# EAGLE design Schematic SF 13_12_2020 V8 (EAGLE 9.6.2)
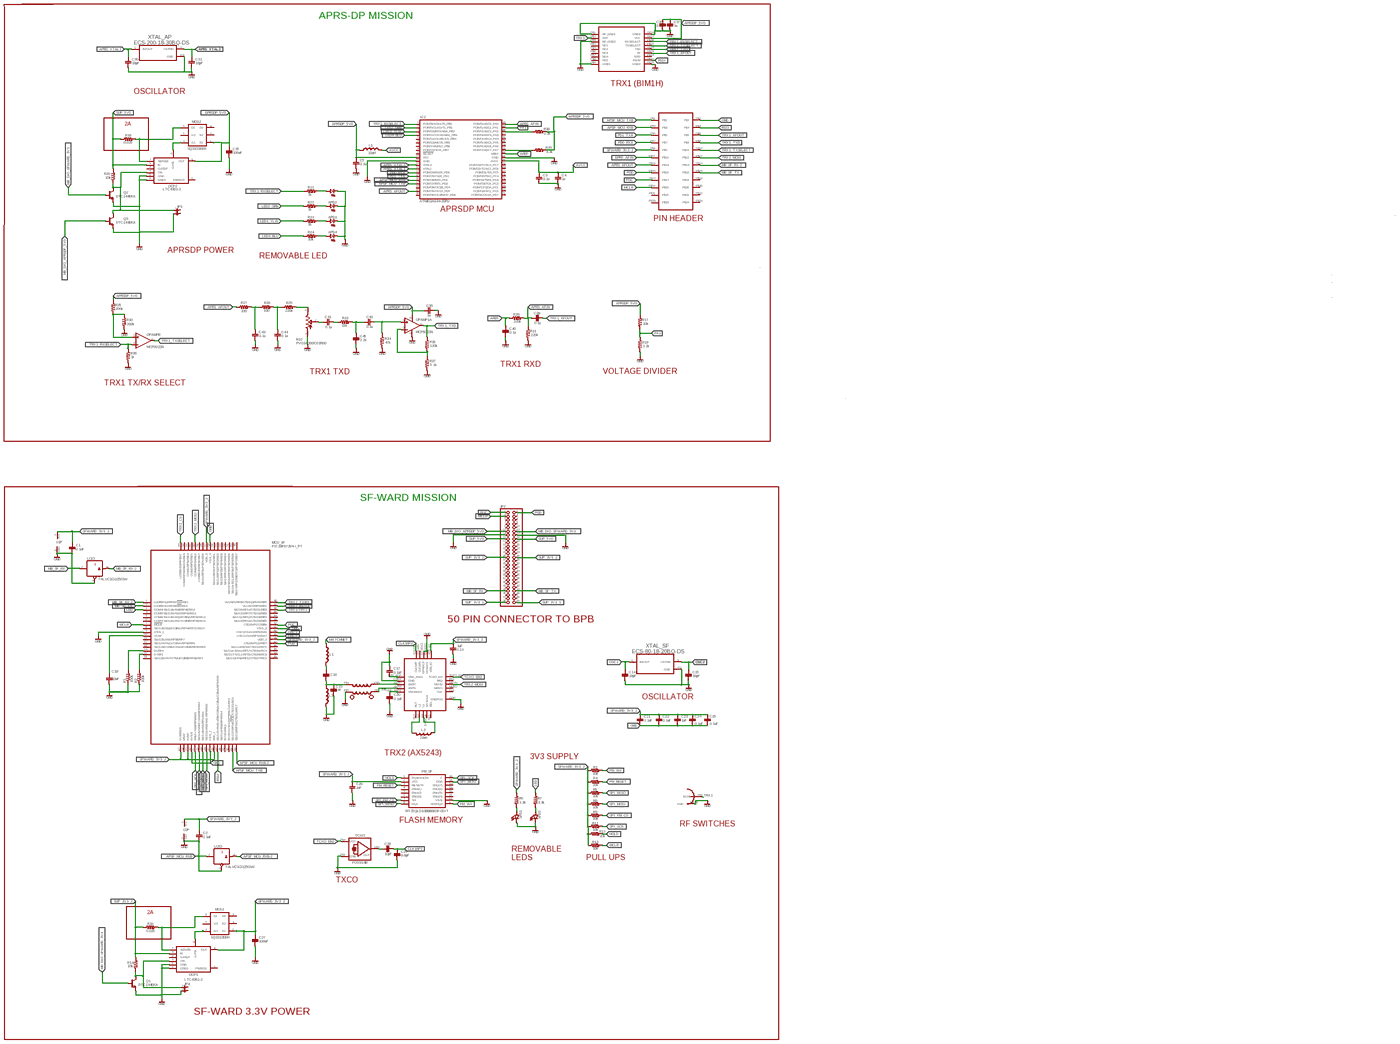
[diagram p0: schematic, sheet 1, overview]
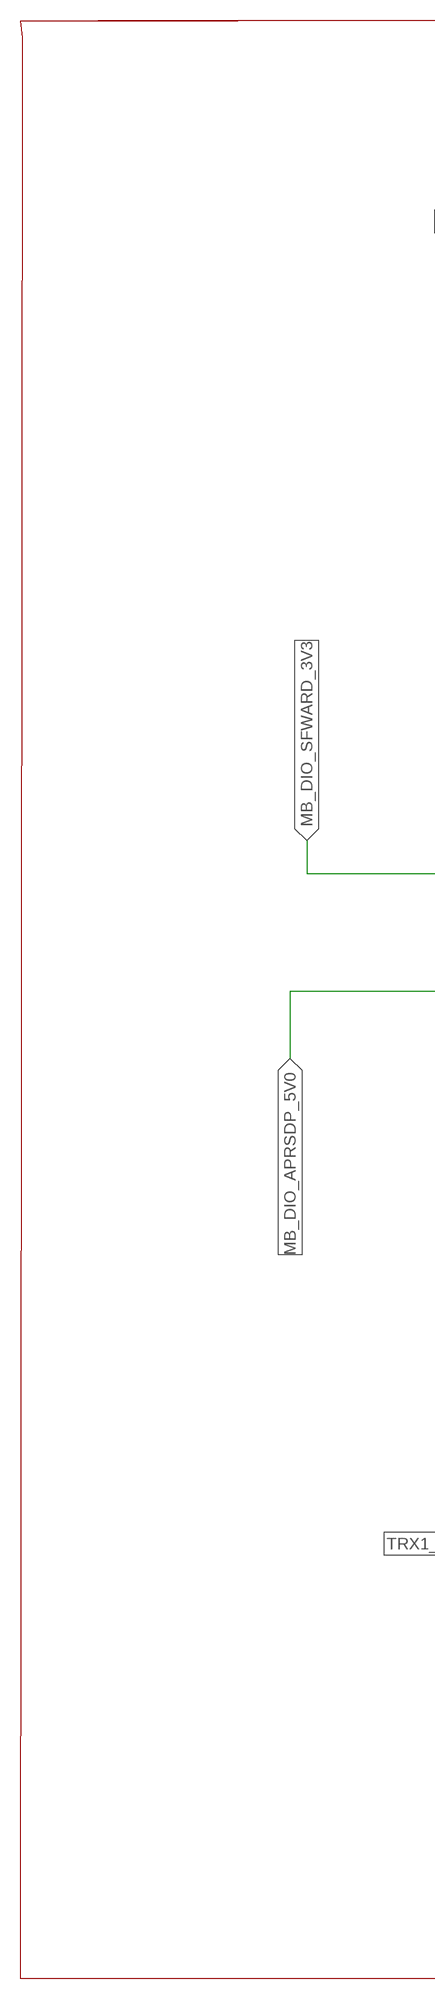
[diagram p1: schematic, sheet 1, part 1 of 4]
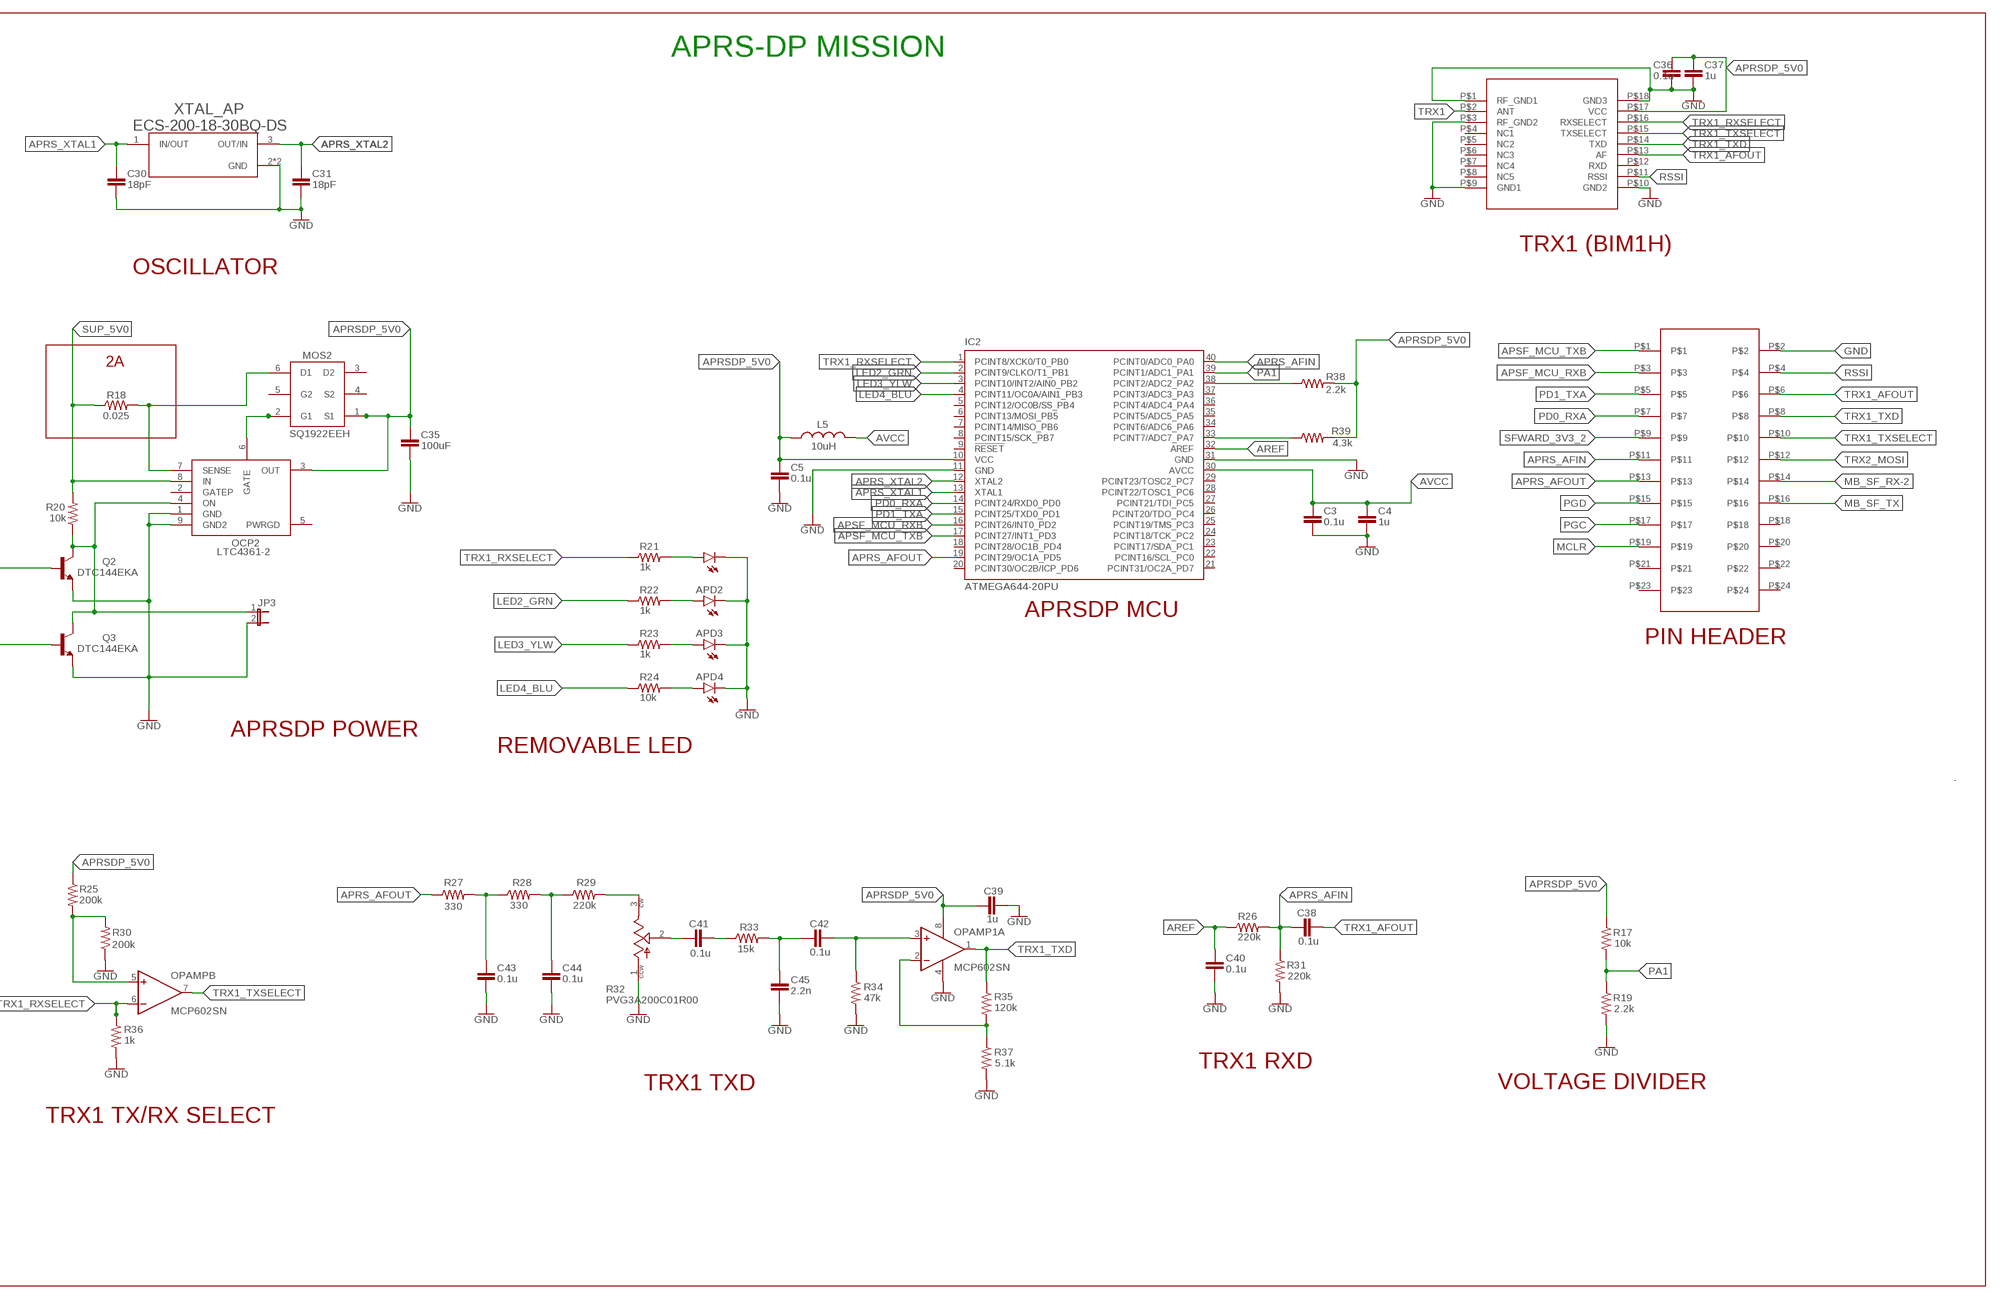
[diagram p2: schematic, sheet 1, part 2 of 4]
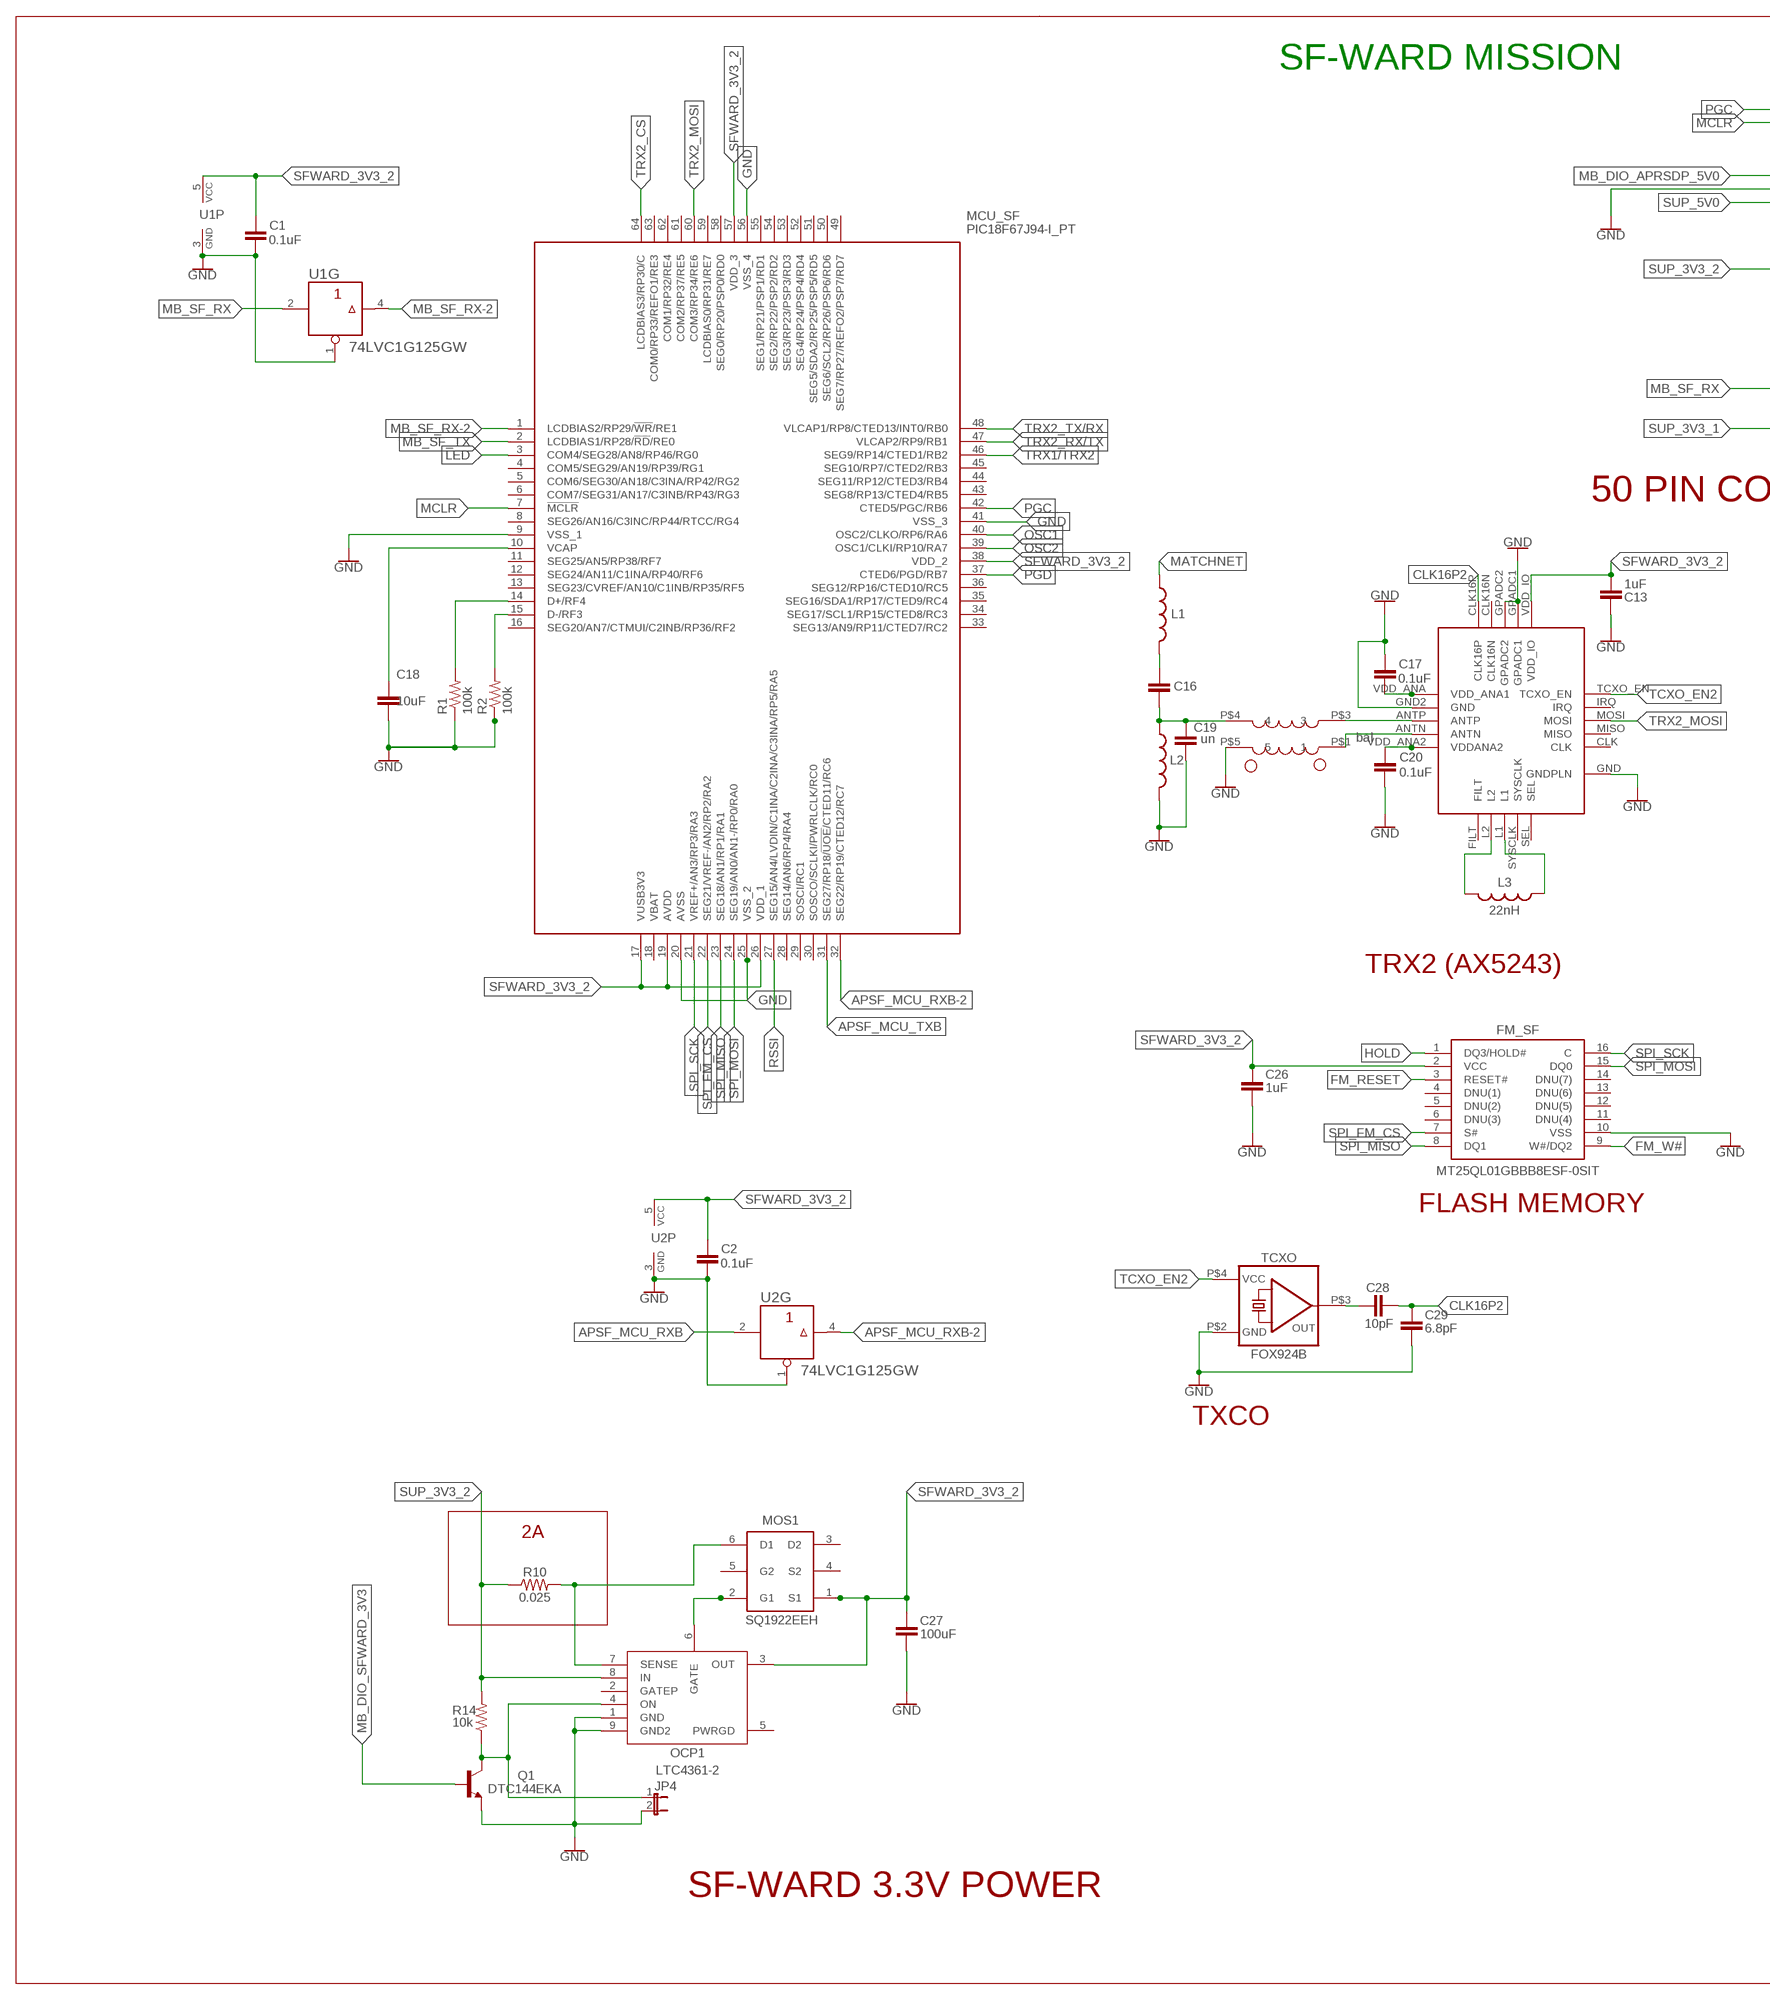
[diagram p3: schematic, sheet 1, part 3 of 4]
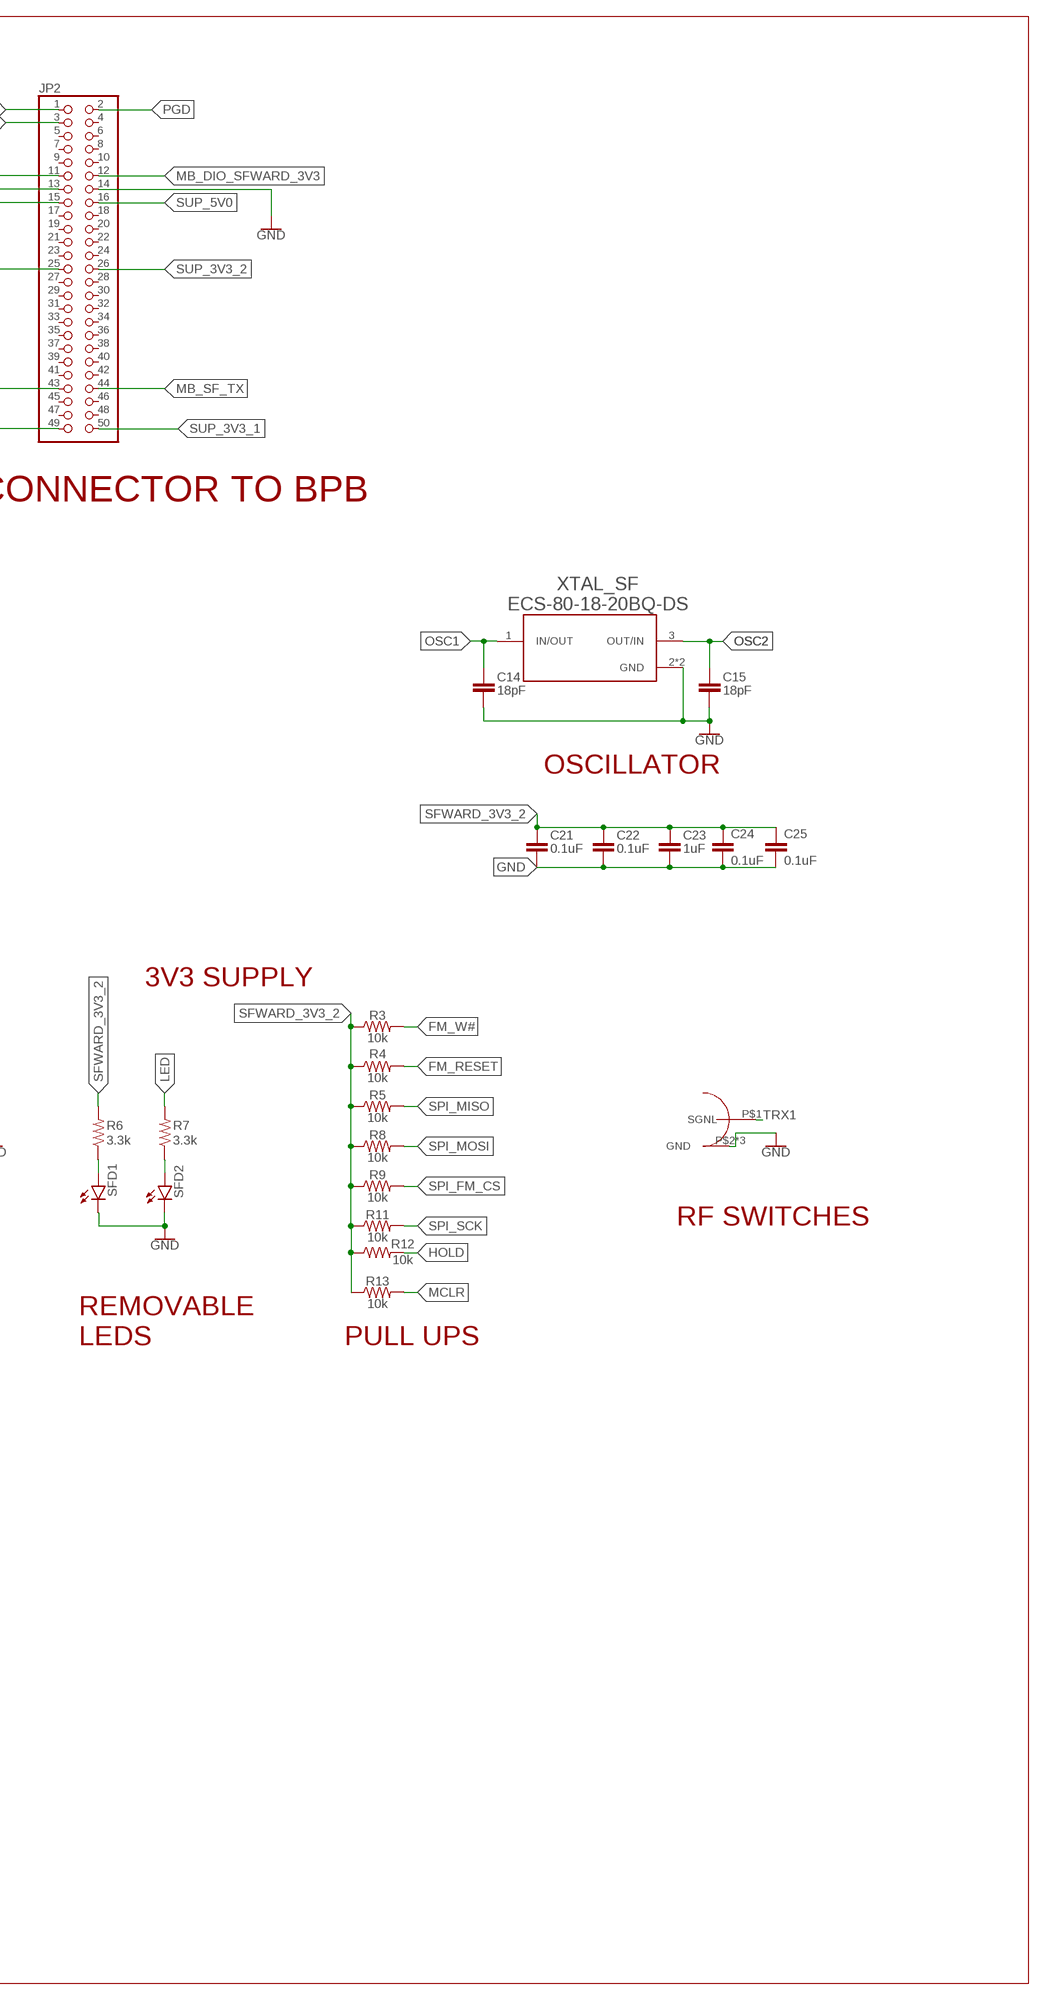
[diagram p4: schematic, sheet 1, part 4 of 4]

## Parts
APD1  LEDSML0603  [SML0603]
APD2  LEDSML0603  [SML0603]
APD3  LEDSML0603  [SML0603]
APD4  LEDSML0603  [SML0603]
BAL  MABA-010245-BALUN  [MABA-010245-BALUN]
C1  0.1uF  CC0603  [C0603]
C2  0.1uF  CC0603  [C0603]
C3  0.1u  CC0603  [C0603]
C4  1u  CC0603  [C0603]
C5  0.1u  CC0603  [C0603]
C13  1uF  CC0603  [C0603]
C14  18pF  CC0603  [C0603]
C15  18pF  CC0603  [C0603]
C16  C-EUC0805  [C0805]
C17  0.1uF  CC0603  [C0603]
C18  10uF  C-EUC0603  [C0603]
C19  C-EUC0805  [C0805]
C20  0.1uF  CC0603  [C0603]
C21  0.1uF  C-EUC0603  [C0603]
C22  0.1uF  C-EUC0603  [C0603]
C23  1uF  C-EUC0603  [C0603]
C24  0.1uF  C-EUC0603  [C0603]
C25  0.1uF  C-EUC0603  [C0603]
C26  1uF  C-EUC0603  [C0603]
C27  100uF  C0805(2012)  [C0805]
C28  10pF  CC0603  [C0603]
C29  6.8pF  CC0603  [C0603]
C30  18pF  CC0603  [C0603]
C31  18pF  CC0603  [C0603]
C35  100uF  C0805(2012)  [C0805]
C36  0.1u  CC0603  [C0603]
C37  1u  CC0603  [C0603]
C38  0.1u  CC0603  [C0603]
C39  1u  CC0603  [C0603]
C40  0.1u  CC0603  [C0603]
C41  0.1u  CC0603  [C0603]
C42  0.1u  CC0603  [C0603]
C43  0.1u  CC0603  [C0603]
C44  0.1u  CC0603  [C0603]
C45  2.2n  CC0603  [C0603]
FM_SF  MT25QL01GBBB8ESF-0SIT  [SOIC127P1032X265-16N]
IC2  ATMEGA644-20PU  [DIL40]
JP1  RAB_ACCESS  [RAB_ACCESS]
JP2  PINHD-2X25_2.00  [2X25M]
JP3  JP1E  [JP1]
JP4  JP1E  [JP1]
L1  L-USL2012C  [L2012C]
L2  L-USL2012C  [L2012C]
L3  22nH  L-USL2012C  [L2012C]
L5  10uH  L-USL2012C  [L2012C]
MCU_SF  PIC18F67J94-I_PT  [QFP50P1200X1200X120-64N]
MOS1  SQ1922EEH  [SOT65P210X110-6N]
MOS2  SQ1922EEH  [SOT65P210X110-6N]
OCP1  LTC4361-2  [DFN]
OCP2  LTC4361-2  [DFN]
OPAMP  MCP602SN  [SO08]
OPAMP1  MCP602SN  [SO08]
Q1  DTC144EKA  [SOT346-R]
Q2  DTC144EKA  [SOT346-R]
Q3  DTC144EKA  [SOT346-R]
R1  100k  R-US_R0603  [R0603]
R2  100k  R-US_R0603  [R0603]
R3  10k  R-US_R0603  [R0603]
R4  10k  R-US_R0603  [R0603]
R5  10k  R-US_R0603  [R0603]
R6  3.3k  R-US_R0603  [R0603]
R7  3.3k  R-US_R0603  [R0603]
R8  10k  R-US_R0603  [R0603]
R9  10k  R-US_R0603  [R0603]
R10  0.025  R0805(2012)  [R0805]
R11  10k  R-US_R0603  [R0603]
R12  10k  R-US_R0603  [R0603]
R13  10k  R-US_R0603  [R0603]
R14  10k  R-US_R0603  [R0603]
R17  10k  R-US_R0603  [R0603]
R18  0.025  R-US_R0805  [R0805]
R19  2.2k  R-US_R0603  [R0603]
R20  10k  R-US_R0603  [R0603]
R21  1k  R-US_R0603  [R0603]
R22  1k  R-US_R0603  [R0603]
R23  1k  R-US_R0603  [R0603]
R24  10k  R-US_R0603  [R0603]
R25  200k  R-US_R0603  [R0603]
R26  220k  R-US_R0603  [R0603]
R27  330  R-US_R0603  [R0603]
R28  330  R-US_R0603  [R0603]
R29  220k  R-US_R0603  [R0603]
R30  200k  R-US_R0603  [R0603]
R31  220k  R-US_R0603  [R0603]
R32  PVG3A200C01R00  [TRIM_PVG3A200C01R00]
R33  15k  R-US_R0603  [R0603]
R34  47k  R-US_R0603  [R0603]
R35  120k  R-US_R0603  [R0603]
R36  1k  R-US_R0603  [R0603]
R37  5.1k  R-US_R0603  [R0603]
R38  2.2k  R-US_R0603  [R0603]
R39  4.3k  R-US_R0603  [R0603]
RFCON  MMCX_908_222101T  [MMCX_908_222101T]
SFD1  LEDCHIPLED_0603  [CHIPLED_0603]
SFD2  LEDCHIPLED_0603  [CHIPLED_0603]
TCXO  FOX924B  [FOX924B]
TRX1  BIM1H  [BIM1H]
TRX2  AX5243  [AX5243]
U1  74LVC1G125GW  [SOT353-1]
U2  74LVC1G125GW  [SOT353-1]
XTAL_AP  ECS-200-18-30BQ-DS  [XTAL_ECS-200-18-30BQ-DS]
XTAL_SF  ECS-80-18-20BQ-DS  [XTAL_ECS-80-18-20BQ-DS]

## Nets
APRS_AFIN: C38.1 IC2.40(PCINT0/ADC0_PA0) JP1.P$11 R26.2 R31.1
APRS_AFOUT: IC2.19(PCINT29/OC1A_PD5) JP1.P$13 R27.1
APRS_XTAL1: C30.1 IC2.13(XTAL1) XTAL_AP.1(IN/OUT)
APRS_XTAL2: C31.1 IC2.12(XTAL2) XTAL_AP.3(OUT/IN)
APRSDP_5V0: C5.2 C35.1 C36.1 C37.1 C39.1 IC2.10(VCC) L5.1 MOS2.1(S1) OCP2.3(OUT) OPAMP1.8(P:V+) R17.1 R25.1 R38.2 R39.2 TRX1.P$17(VCC)
APSF_MCU_RXB: IC2.16(PCINT26/INT0_PD2) JP1.P$3 U2.2(G:A)
APSF_MCU_RXB-2: MCU_SF.32(SEG22/RP19/CTED12/RC7) U2.4(G:Y)
APSF_MCU_TXB: IC2.17(PCINT27/INT1_PD3) JP1.P$1 MCU_SF.31(SEG27/RP18/!UOE!/CTED11/RC6)
AREF: C40.1 IC2.32(AREF) R26.1
AVCC: C3.1 C4.1 IC2.30(AVCC) L5.2
CLK16P2: C28.2 C29.1 TRX2.CLK16P
FM_RESET: FM_SF.3(RESET#) R4.2
FM_W#: FM_SF.9(W#/DQ2) R3.2
GATE3: MOS1.2(G1) OCP1.6(GATE)
GATE4: MOS2.2(G1) OCP2.6(GATE)
GND: APD1.C APD2.C APD3.C APD4.C BAL.P$5 C1.1 C2.1 C3.2 C4.2 C5.1 C13.1 C14.2 C15.2 C17.2 C18.2 C19.2 C20.2 C21.2 C22.2 C23.2 C24.2 C25.2 C26.2 C27.2 C29.2 C30.2 C31.2 C35.2 C36.2 C37.2 C39.2 C40.2 C43.2 C44.2 C45.2 FM_SF.10(VSS) IC2.11(GND) IC2.31(GND) JP1.P$2 JP2.13 JP2.14 JP3.2 JP4.2 L2.2 MCU_SF.9(VSS_1) MCU_SF.20(AVSS) MCU_SF.25(VSS_2) MCU_SF.41(VSS_3) MCU_SF.56(VSS_4) OCP1.1(GND) OCP1.9(GND2) OCP2.1(GND) OCP2.9(GND2) OPAMP1.4(P:V-) Q1.1(E) Q2.1(E) Q3.1(E) R1.1 R2.1 R19.2 R30.1 R31.2 R32.1(CCW) R34.2 R36.2 R37.2 RFCON.P$2(GND) RFCON.P$3(GND) RFCON.P$4(GND) SFD1.C SFD2.C TCXO.P$2(GND) TRX1.P$1(RF_GND1) TRX1.P$3(RF_GND2) TRX1.P$9(GND1) TRX1.P$10(GND2) TRX1.P$18(GND3) TRX2.GND2(GND) TRX2.GND(GNDPLN) TRX2.GPADC1 TRX2.GPADC2 U1.1(G:OEN) U1.3(P:GND) U2.1(G:OEN) U2.3(P:GND) XTAL_AP.2(GND) XTAL_AP.4(GND) XTAL_SF.2(GND) XTAL_SF.4(GND)
HOLD: FM_SF.1(DQ3/HOLD#) R12.2
LED: MCU_SF.3(COM4/SEG28/AN8/RP46/RG0) R7.2
LED2_GRN: IC2.2(PCINT9/CLKO/T1_PB1) R22.1
LED3_YLW: IC2.3(PCINT10/INT2/AIN0_PB2) R23.1
LED4_BLU: IC2.4(PCINT11/OC0A/AIN1_PB3) R24.1
MATCHNET: L1.1
MB_DIO_APRSDP_5V0: JP2.11 Q3.2(B)
MB_DIO_SFWARD_3V3: JP2.12 Q1.2(B) Q2.2(B)
MB_SF_RX: JP2.43 U1.2(G:A)
MB_SF_RX-2: JP1.P$14 MCU_SF.1(LCDBIAS2/RP29/!WR!/RE1) U1.4(G:Y)
MB_SF_TX: JP1.P$16 JP2.44 MCU_SF.2(LCDBIAS1/RP28/!RD!/RE0)
MCLR: JP1.P$19 JP2.3 MCU_SF.7(!MCLR) R13.2
N$2: C18.1 MCU_SF.10(VCAP)
N$7: MCU_SF.14(D+/RF4) R1.2
N$8: MCU_SF.15(D-/RF3) R2.2
N$9: R6.1 SFD1.A
N$10: R29.2 R32.3(CW)
N$11: R7.1 SFD2.A
N$12: APD1.A R21.2
N$13: APD2.A R22.2
N$14: APD3.A R23.2
N$15: APD4.A R24.2
N$16: C43.1 R27.2 R28.1
N$17: C44.1 R28.2 R29.1
N$18: C42.1 C45.1 R33.2
N$19: C41.2 R33.1
N$20: OPAMP1.2(A:-IN) R35.2 R37.1
N$21: OPAMP.5(B:+IN) R25.2 R30.2
N$22: C41.1 R32.2(WIPER)
N$34: IC2.38(PCINT2/ADC2_PA2) R38.1
N$35: C20.1 TRX2.VDD_ANA2(VDDANA2)
N$36: C17.1 TRX2.VDD_ANA(VDD_ANA1)
N$37: L3.2 TRX2.L2
N$38: IC2.33(PCINT7/ADC7_PA7) R39.1
N$41: L3.1 TRX2.L1
N$42: C16.1 L1.2
N$43: BAL.P$4 C16.2 C19.1 L2.1
N$44: BAL.P$1 TRX2.ANTN
N$45: BAL.P$3 TRX2.ANTP
N$46: C28.1 TCXO.P$3(OUT)
ON3: JP4.1 OCP1.4(ON) Q1.3(C) R14.1
ON4: JP3.1 OCP2.4(ON) Q2.3(C) Q3.3(C) R20.1
OPAMP_A+: C42.2 OPAMP1.3(A:+IN) R34.1
OSC1: C14.1 MCU_SF.40(OSC2/CLKO/RP6/RA6) XTAL_SF.1(IN/OUT)
OSC2: C15.1 MCU_SF.39(OSC1/CLKI/RP10/RA7) XTAL_SF.3(OUT/IN)
PA1: IC2.39(PCINT1/ADC1_PA1) R17.2 R19.1
PD0_RXA: IC2.14(PCINT24/RXD0_PD0) JP1.P$7
PD1_TXA: IC2.15(PCINT25/TXD0_PD1) JP1.P$5
PGC: JP1.P$17 JP2.1 MCU_SF.42(CTED5/PGC/RB6)
PGD: JP1.P$15 JP2.2 MCU_SF.37(CTED6/PGD/RB7)
RSSI: JP1.P$4 MCU_SF.27(SEG15/AN4/LVDIN/C1INA/C2INA/C3INA/RP5/RA5) TRX1.P$11(RSSI)
SENSE3: MOS1.6(D1) OCP1.7(SENSE) R10.2
SENSE4: MOS2.6(D1) OCP2.7(SENSE) R18.2
SFWARD_3V3_2: C1.2 C2.2 C13.2 C21.1 C22.1 C23.1 C24.1 C25.1 C26.1 C27.1 FM_SF.2(VCC) JP1.P$9 MCU_SF.17(VUSB3V3) MCU_SF.19(AVDD) MCU_SF.26(VDD_1) MCU_SF.38(VDD_2) MCU_SF.57(VDD_3) MOS1.1(S1) OCP1.3(OUT) R3.1 R4.1 R5.1 R6.2 R8.1 R9.1 R11.1 R12.1 R13.1 TRX2.VDD_IO U1.5(P:VCC) U2.5(P:VCC)
SPI_FM_CS: FM_SF.7(S#) MCU_SF.22(SEG21/VREF-/AN2/RP2/RA2) R9.2
SPI_MISO: FM_SF.8(DQ1) MCU_SF.23(SEG18/AN1/RP1/RA1) R5.2
SPI_MOSI: FM_SF.15(DQ0) MCU_SF.24(SEG19/AN0/AN1-/RP0/RA0) R8.2
SPI_SCK: FM_SF.16(C) MCU_SF.21(VREF+/AN3/RP3/RA3) R11.2
SUP_3V3_1: JP2.49 JP2.50
SUP_3V3_2: JP2.25 JP2.26 OCP1.8(IN) R10.1 R14.2
SUP_5V0: JP2.15 JP2.16 OCP2.8(IN) R18.1 R20.2
TCXO_EN2: TCXO.P$4(VCC) TRX2.TCXO_EN
TRX1: RFCON.P$1(SGNL) TRX1.P$2(ANT)
TRX1/TRX2: MCU_SF.46(SEG9/RP14/CTED1/RB2)
TRX1_AFOUT: C38.2 JP1.P$6 TRX1.P$13(AF)
TRX1_RXSELECT: IC2.1(PCINT8/XCK0/T0_PB0) OPAMP.6(B:-IN) R21.1 R36.1 TRX1.P$16(RXSELECT)
TRX1_TXD: JP1.P$8 OPAMP1.1(A:OUT) R35.1 TRX1.P$14(TXD)
TRX1_TXSELECT: JP1.P$10 OPAMP.7(B:OUT) TRX1.P$15(TXSELECT)
TRX2_CS: MCU_SF.64(LCDBIAS3/RP30/C)
TRX2_MOSI: JP1.P$12 MCU_SF.60(COM3/RP34/RE6) TRX2.MOSI
TRX2_RX/TX: MCU_SF.47(VLCAP2/RP9/RB1)
TRX2_TX/RX: MCU_SF.48(VLCAP1/RP8/CTED13/INT0/RB0)
Unconnected: FM_SF.4(DNU(1)) FM_SF.5(DNU(2)) FM_SF.6(DNU(3)) FM_SF.11(DNU(4)) FM_SF.12(DNU(5)) FM_SF.13(DNU(6)) FM_SF.14(DNU(7)) IC2.5(PCINT12/OC0B/SS_PB4) IC2.6(PCINT13/MOSI_PB5) IC2.7(PCINT14/MISO_PB6) IC2.8(PCINT15/SCK_PB7) IC2.9(!RESET) IC2.18(PCINT28/OC1B_PD4) IC2.20(PCINT30/OC2B/ICP_PD6) IC2.21(PCINT31/OC2A_PD7) IC2.22(PCINT16/SCL_PC0) IC2.23(PCINT17/SDA_PC1) IC2.24(PCINT18/TCK_PC2) IC2.25(PCINT19/TMS_PC3) IC2.26(PCINT20/TDO_PC4) IC2.27(PCINT21/TDI_PC5) IC2.28(PCINT22/TOSC1_PC6) IC2.29(PCINT23/TOSC2_PC7) IC2.34(PCINT6/ADC6_PA6) IC2.35(PCINT5/ADC5_PA5) IC2.36(PCINT4/ADC4_PA4) IC2.37(PCINT3/ADC3_PA3) JP1.P$18 JP1.P$20 JP1.P$21 JP1.P$22 JP1.P$23 JP1.P$24 JP2.4 JP2.5 JP2.6 JP2.7 JP2.8 JP2.9 JP2.10 JP2.17 JP2.18 JP2.19 JP2.20 JP2.21 JP2.22 JP2.23 JP2.24 JP2.27 JP2.28 JP2.29 JP2.30 JP2.31 JP2.32 JP2.33 JP2.34 JP2.35 JP2.36 JP2.37 JP2.38 JP2.39 JP2.40 JP2.41 JP2.42 JP2.45 JP2.46 JP2.47 JP2.48 MCU_SF.4(COM5/SEG29/AN19/RP39/RG1) MCU_SF.5(COM6/SEG30/AN18/C3INA/RP42/RG2) MCU_SF.6(COM7/SEG31/AN17/C3INB/RP43/RG3) MCU_SF.8(SEG26/AN16/C3INC/RP44/RTCC/RG4) MCU_SF.11(SEG25/AN5/RP38/RF7) MCU_SF.12(SEG24/AN11/C1INA/RP40/RF6) MCU_SF.13(SEG23/CVREF/AN10/C1INB/RP35/RF5) MCU_SF.16(SEG20/AN7/CTMUI/C2INB/RP36/RF2) MCU_SF.18(VBAT) MCU_SF.28(SEG14/AN6/RP4/RA4) MCU_SF.29(SOSCI/RC1) MCU_SF.30(SOSCO/SCLKI/PWRLCLK/RC0) MCU_SF.33(SEG13/AN9/RP11/CTED7/RC2) MCU_SF.34(SEG17/SCL1/RP15/CTED8/RC3) MCU_SF.35(SEG16/SDA1/RP17/CTED9/RC4) MCU_SF.36(SEG12/RP16/CTED10/RC5) MCU_SF.43(SEG8/RP13/CTED4/RB5) MCU_SF.44(SEG11/RP12/CTED3/RB4) MCU_SF.45(SEG10/RP7/CTED2/RB3) MCU_SF.49(SEG7/RP27/REFO2/PSP7/RD7) MCU_SF.50(SEG6/SCL2/RP26/PSP6/RD6) MCU_SF.51(SEG5/SDA2/RP25/PSP5/RD5) MCU_SF.52(SEG4/RP24/PSP4/RD4) MCU_SF.53(SEG3/RP23/PSP3/RD3) MCU_SF.54(SEG2/RP22/PSP2/RD2) MCU_SF.55(SEG1/RP21/PSP1/RD1) MCU_SF.58(SEG0/RP20/PSP0/RD0) MCU_SF.59(LCDBIAS0/RP31/RE7) MCU_SF.61(COM2/RP37/RE5) MCU_SF.62(COM1/RP32/RE4) MCU_SF.63(COM0/RP33/REFO1/RE3) MOS1.3(D2) MOS1.4(S2) MOS1.5(G2) MOS2.3(D2) MOS2.4(S2) MOS2.5(G2) OCP1.2(GATEP) OCP1.5(PWRGD) OCP2.2(GATEP) OCP2.5(PWRGD) OPAMP1.5(B:+IN) OPAMP1.6(B:-IN) OPAMP1.7(B:OUT) OPAMP.1(A:OUT) OPAMP.2(A:-IN) OPAMP.3(A:+IN) TRX1.P$4(NC1) TRX1.P$5(NC2) TRX1.P$6(NC3) TRX1.P$7(NC4) TRX1.P$8(NC5) TRX1.P$12(RXD) TRX2.CLK TRX2.CLK16N TRX2.FILT TRX2.IRQ TRX2.MISO TRX2.SEL TRX2.SYSCLK

## Notes on the sheet
- APRS-DP MISSION
- TRX1 (BIM1H)
- OSCILLATOR
- 2A
- APRSDP MCU
- PIN HEADER
- APRSDP POWER
- REMOVABLE LED
- TRX1 RXD
- TRX1 TXD | VOLTAGE DIVIDER
- TRX1 TX/RX SELECT
- SF-WARD MISSION
- 50 PIN CONNECTOR TO BPB
- OSCILLATOR
- TRX2 (AX5243)
- 3V3 SUPPLY
- FLASH MEMORY
- RF SWITCHES
- REMOVABLE
  LEDS
- PULL UPS
- TXCO
- 2A
- SF-WARD 3.3V POWER

## Power pins joined to a net without a drawn wire
V+: OPAMP.8(P:V+)
V-: OPAMP.4(P:V-)

## Library data of the parts
APD1-APD4 SFD1 SFD2 = led:LED: LED OSRAM: - CHIPLED LG R971, LG N971, LY N971, LG Q971, LY Q971, LO R971, LY R971 LH N974, LH R974 LS Q976, LO Q976, LY Q976 LO Q996 - Hyper CHIPLED LW Q18S LB Q993, LB Q99A, LB R99A - SideLED LS A670, LO A670, LY A670, LG A670, LP A670 LB A673, LV A673, LT A673, LW A673 LH A674 LY A675 LS A676, LA A676, LO A676, LY A676, LW A676 LS A679, LY A679, LG A679 - Hyper Micro SIDELED® LS Y876, LA Y876, LO Y876, LY Y876 LT Y87S - SmartLED LW L88C, LW L88S LB L89C, LB L89S, LG L890 LS L89K, LO L89K, LY L89K LS L896, LA L896, LO L896, LY L896 - TOPLED LS T670, LO T670, LY T670, LG T670, LP T670 LSG T670, LSP T670, LSY T670, LOP T670, LYG T670 LG T671, LOG T671, LSG T671 LB T673, LV T673, LT T673, LW T673 LH T674 LS T676, LA T676, LO T676, LY T676, LB T676, LH T676, LSB T676, LW T676 LB T67C, LV T67C, LT T67C, LS T67K, LO T67K, LY T67K, LW E67C LS E67B, LA E67B, LO E67B, LY E67B, LB E67C, LV E67C, LT E67C LW T67C LS T679, LY T679, LG T679 LS T770, LO T770, LY T770, LG T770, LP T770 LB T773, LV T773, LT T773, LW T773 LH T774 LS E675, LA E675, LY E675, LS T675 LS T776, LA T776, LO T776, LY T776, LB T776 LHGB T686 LT T68C, LB T68C - Hyper Mini TOPLED® LB M676 - Mini TOPLED Santana® LG M470 LS M47K, LO M47K, LY M47K Source: http://www.osram.convergy.de LUXEON: - LUMILED® LXK2-PW12-R00, LXK2-PW12-S00, LXK2-PW14-U00, LXK2-PW14-V00 LXK2-PM12-R00, LXK2-PM12-S00, LXK2-PM14-U00 LXK2-PE12-Q00, LXK2-PE12-R00, LXK2-PE12-S00, LXK2-PE14-T00, LXK2-PE14-U00 LXK2-PB12-K00, LXK2-PB12-L00, LXK2-PB12-M00, LXK2-PB14-N00, LXK2-PB14-P00, LXK2-PB14-Q00 LXK2-PR12-L00, LXK2-PR12-M00, LXK2-PR14-Q00, LXK2-PR14-R00 LXK2-PD12-Q00, LXK2-PD12-R00, LXK2-PD12-S00 LXK2-PH12-R00, LXK2-PH12-S00 LXK2-PL12-P00, LXK2-PL12-Q00, LXK2-PL12-R00 Source: www.luxeon.com KINGBRIGHT: KA-3528ASYC Source: www.kingbright.com
BAL = BIRDS_4_general_components_library:MABA-010245-BALUN
C1-C5 C13-C15 C17 C20 C28-C31 C36-C45 = eagle-ltspice:C: CAPACITOR, European symbol; SPICEMODEL: NONE; SPICEPREFIX: C
C16 C18 C19 C21-C26 = rcl:C-EU: CAPACITOR, European symbol; SPICEPREFIX: C
C27 C35 = BIRDS3_CAM_MSN:C0805(2012)
FM_SF = BIRDS3_CAM_MSN:MT25QL01GBBB8ESF-0SIT: IC FLASH 1GBIT 108MHZ 16SOIC Source: Datasheet <https://www.micron.com/~/media/documents/products/data-sheet/nor-flash/serial-nor/mt25q/die-rev-b/mt25q_qlkt_l_01g_bbb_0.pdf>; DESCRIPTION: IC FLASH 1GBIT 108MHZ 16SOIC; HEIGHT: 2.65mm; MANUFACTURER_NAME: Micron; MANUFACTURER_PART_NUMBER: MT25QL01GBBB8ESF-0SIT; SUPPLIER_NAME: RS
IC2 = atmel:ATMEGA644-*PU: 8-bit Microcontroller with 64K Bytes In-System Programmable Flash Auto generated by make-symbol-device-package-bsdl.ulp Rev. 34 Source: http://www.atmel.com/dyn/resources/prod_documents/doc2593.pdf; MPN: ATMEGA644-20PU; OC_FARNELL: 1288340; OC_NEWARK: 23M5060
JP1 = BIRDS_4_general_components_library:RAB_ACCESS
JP2 = pinhead-1:PINHD-2X25: PIN HEADER
JP3 JP4 = jumper:JP1E: JUMPER
L1-L3 L5 = rcl:L-US: INDUCTOR, American symbol; SPICEPREFIX: L
MCU_SF = PIC18F67J94-I_PT:PIC18F67J94-I_PT: MCU 8-Bit 128K Flash LCD USB XLP TQFP64 Microchip PIC18F67J94-I/PT, 8bit PIC Microcontroller, 64MHz, 128 kB Flash, 64-Pin TQFP Source: Datasheet <http://uk.rs-online.com/web/p/products/8233908>; ALLIED_NUMBER: 70470236; ALLIED_PRICE-STOCK: https://www.alliedelec.com/microchip-technology-inc-pic18f67j94-i-pt/70470236/; DESCRIPTION: MCU 8-Bit 128K Flash LCD USB XLP TQFP64 Microchip PIC18F67J94-I/PT, 8bit PIC Microcontroller, 64MHz, 128 kB Flash, 64-Pin TQFP; HEIGHT: 1.2mm; MANUFACTURER_NAME: Microchip; MANUFACTURER_PART_NUMBER: PIC18F67J94-I/PT; MOUSER_PART_NUMBER: 579-PIC18F67J94-I/PT; MOUSER_PRICE-STOCK: https://www.mouser.com/Search/Refine.aspx?Keyword=579-PIC18F67J94-I%2FPT; RS_PART_NUMBER: 1652172; RS_PRICE-STOCK: http://uk.rs-online.com/web/p/products/1652172
MOS1 MOS2 = BIRDS3_CAM_MSN:SQ1922EEH
OCP1 OCP2 = BIRDS3_CAM_MSN:LTC4361-2
OPAMP OPAMP1 = linear:MCP602: Single Op Amp 2.7V to 6.0V Single Supply CMOS Source: http://ww1.microchip.com/downloads/en/DeviceDoc/21314g.pdf
Q1-Q3 = BIRDS3_CAM_MSN:DTC144EKA
R1-R9 R11-R14 R17-R31 R33-R39 = rcl:R-US_: RESISTOR, American symbol; SPICEPREFIX: R
R10 = BIRDS3_CAM_MSN:R0805(2012)
R32 = PVG3A200C01R00:PVG3A200C01R00: Res Cermet Trimmer 20 Ohm 20% 1/4W 1(Elec)/1(Mech)Turn 2.2mm (3.6 X 3.6 X 2mm) J-Hook SMD T/R; DESCRIPTION: Trimmer 20 Ohm 0.25w Smd; DIGI-KEY_PART_NUMBER: 490-2647-1-ND; DIGI-KEY_PURCHASE_URL: https://www.digikey.jp/product-detail/en/bourns-inc/PVG3A200C01R00/490-2647-1-ND/666223?utm_source=snapeda&utm_medium=aggregator&utm_campaign=symbol; MF: Bourns; MP: PVG3A200C01R00; PACKAGE: TO-221 Bourns
RFCON = BIRDS_4_general_components_library:MMCX_908_222101T
TCXO = BIRDS_4_general_components_library:FOX924B
TRX1 = BIRDS_4_general_components_library:BIM1H
TRX2 = BIRDS_4_general_components_library:AX5243
U1 U2 = Buffers:74LVC1G125: Bus buffer/line driver; 3-state The 74LVC1G125 provides one non-inverting buffer/line driver with 3-state output. The 3-state output is controlled by the output enable input (OE). A HIGH-level at pin OE causes the output to assume a high-impedance OFF-state. The input can be driven from either 3.3 V or 5 V devices. This feature allows the use of this device in a mixed 3.3 V and 5 V environment. This device is fully specified for partial power-down applications using IOFF. The IOFF circuitry disables the output, preventing the damaging backflow current through the device when it is powered down. AAL Eindhoven MK
XTAL_AP = ECS-200-18-30BQ-DS:ECS-200-18-30BQ-DS: The ECX-53BQ is a miniature SMD Crystal with a 3.2 x 5 mm footprint. AEC-Q200 Qualified.; DESCRIPTION: Crystal 20.0000mhz 18pf Smd; DIGI-KEY_PART_NUMBER: XC1997CT-ND; DIGI-KEY_PURCHASE_URL: https://www.digikey.jp/product-detail/en/ecs-inc/ECS-200-18-30BQ-DS/XC1997CT-ND/4073672?utm_source=snapeda&utm_medium=aggregator&utm_campaign=symbol; MF: ECS Inc.; MP: ECS-200-18-30BQ-DS; PACKAGE: SMD-4 ECS International
XTAL_SF = ECS-80-18-20BQ-DS:ECS-80-18-20BQ-DS: compact SMD Crystal; DESCRIPTION: 8.0000MHZ 18PF SMD, CSM-8Q, 100ppm, 30ppm, 18pF Crystal; DIGI-KEY_PART_NUMBER: XC2015CT-ND; DIGI-KEY_PURCHASE_URL: https://www.digikey.jp/product-detail/en/ecs-inc/ECS-80-18-20BQ-DS/XC2015CT-ND/4073726?utm_source=snapeda&utm_medium=aggregator&utm_campaign=symbol; MF: ECS Inc.; MP: ECS-80-18-20BQ-DS; PACKAGE: SMD-4 ECS International

## Board
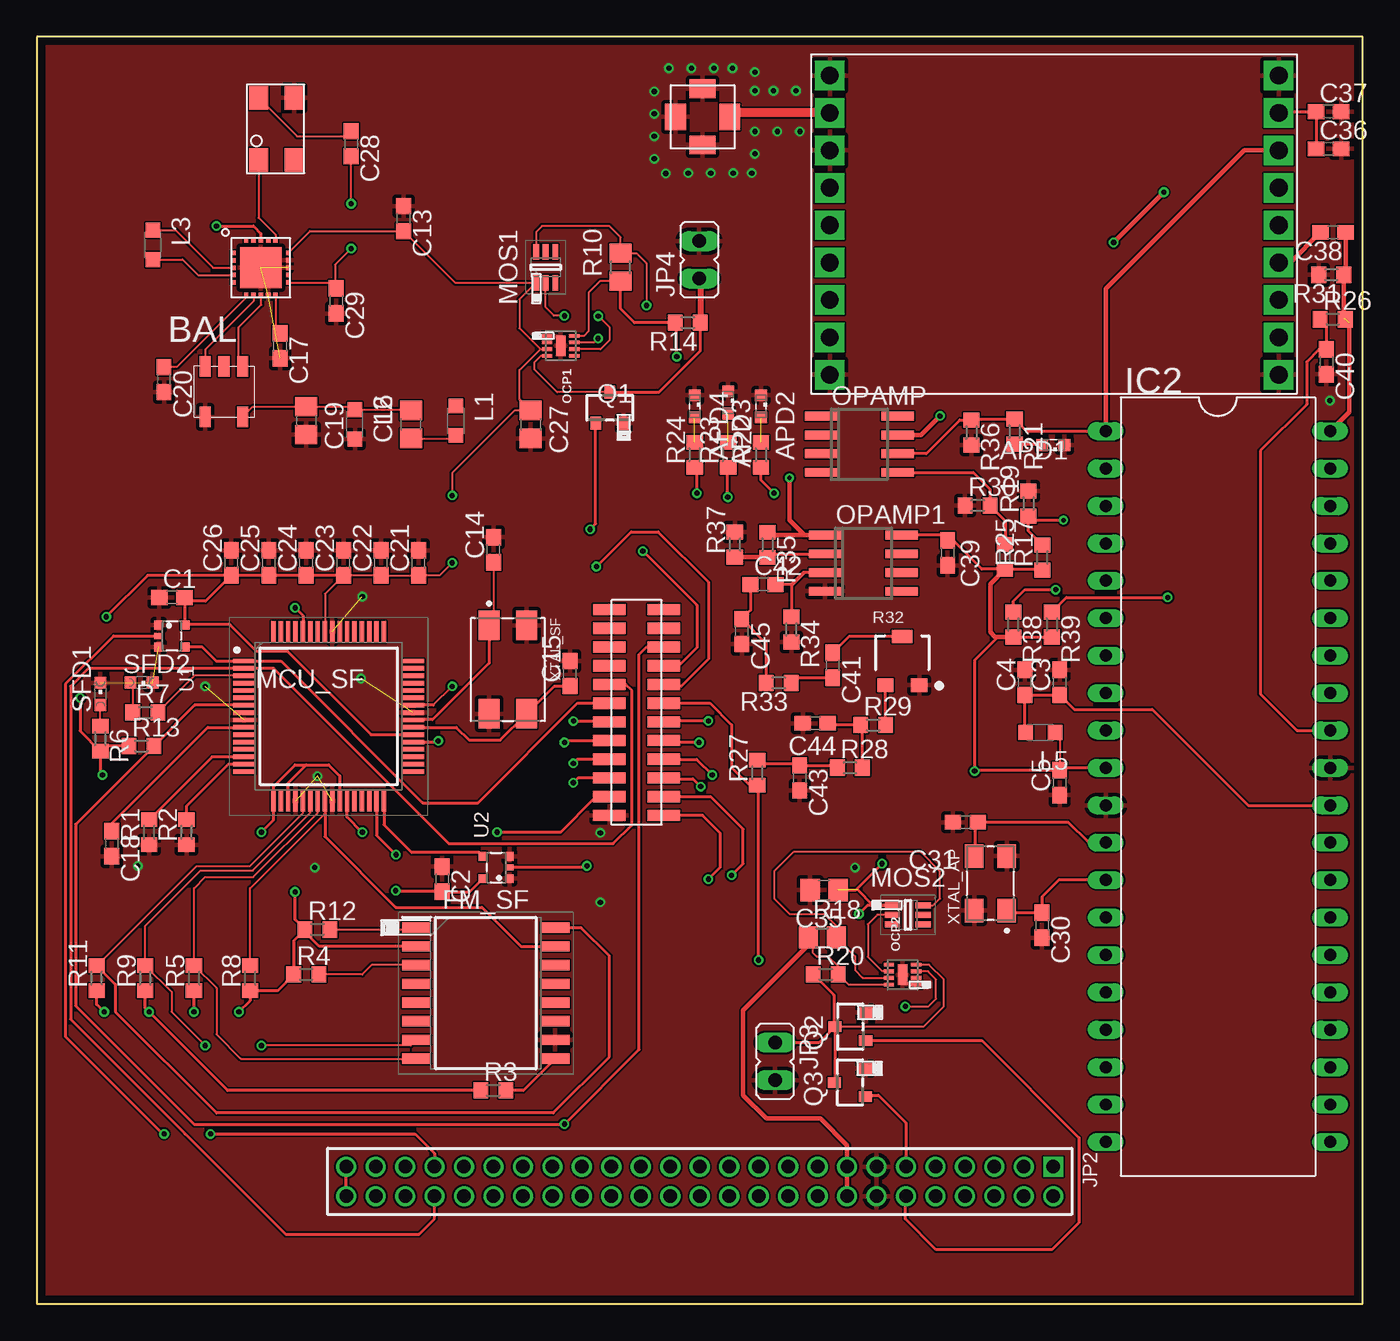
[diagram p5: board, top side]
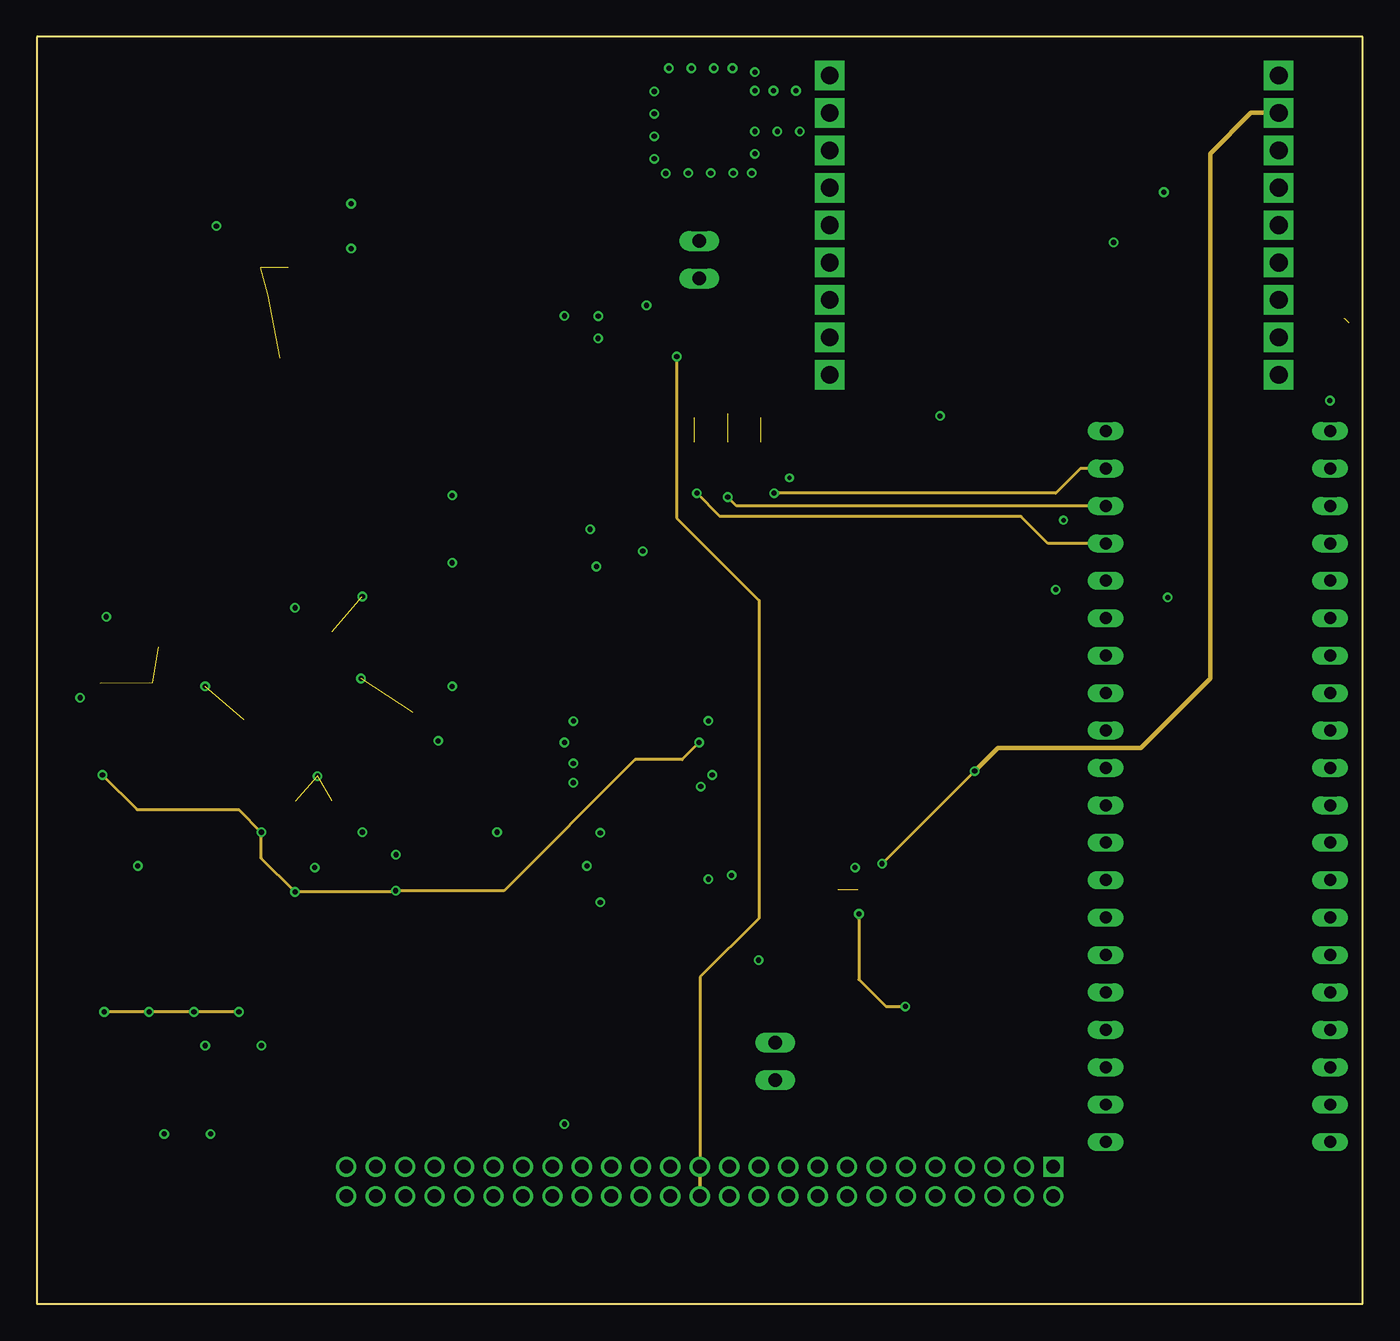
[diagram p6: board, inner layer Route2]
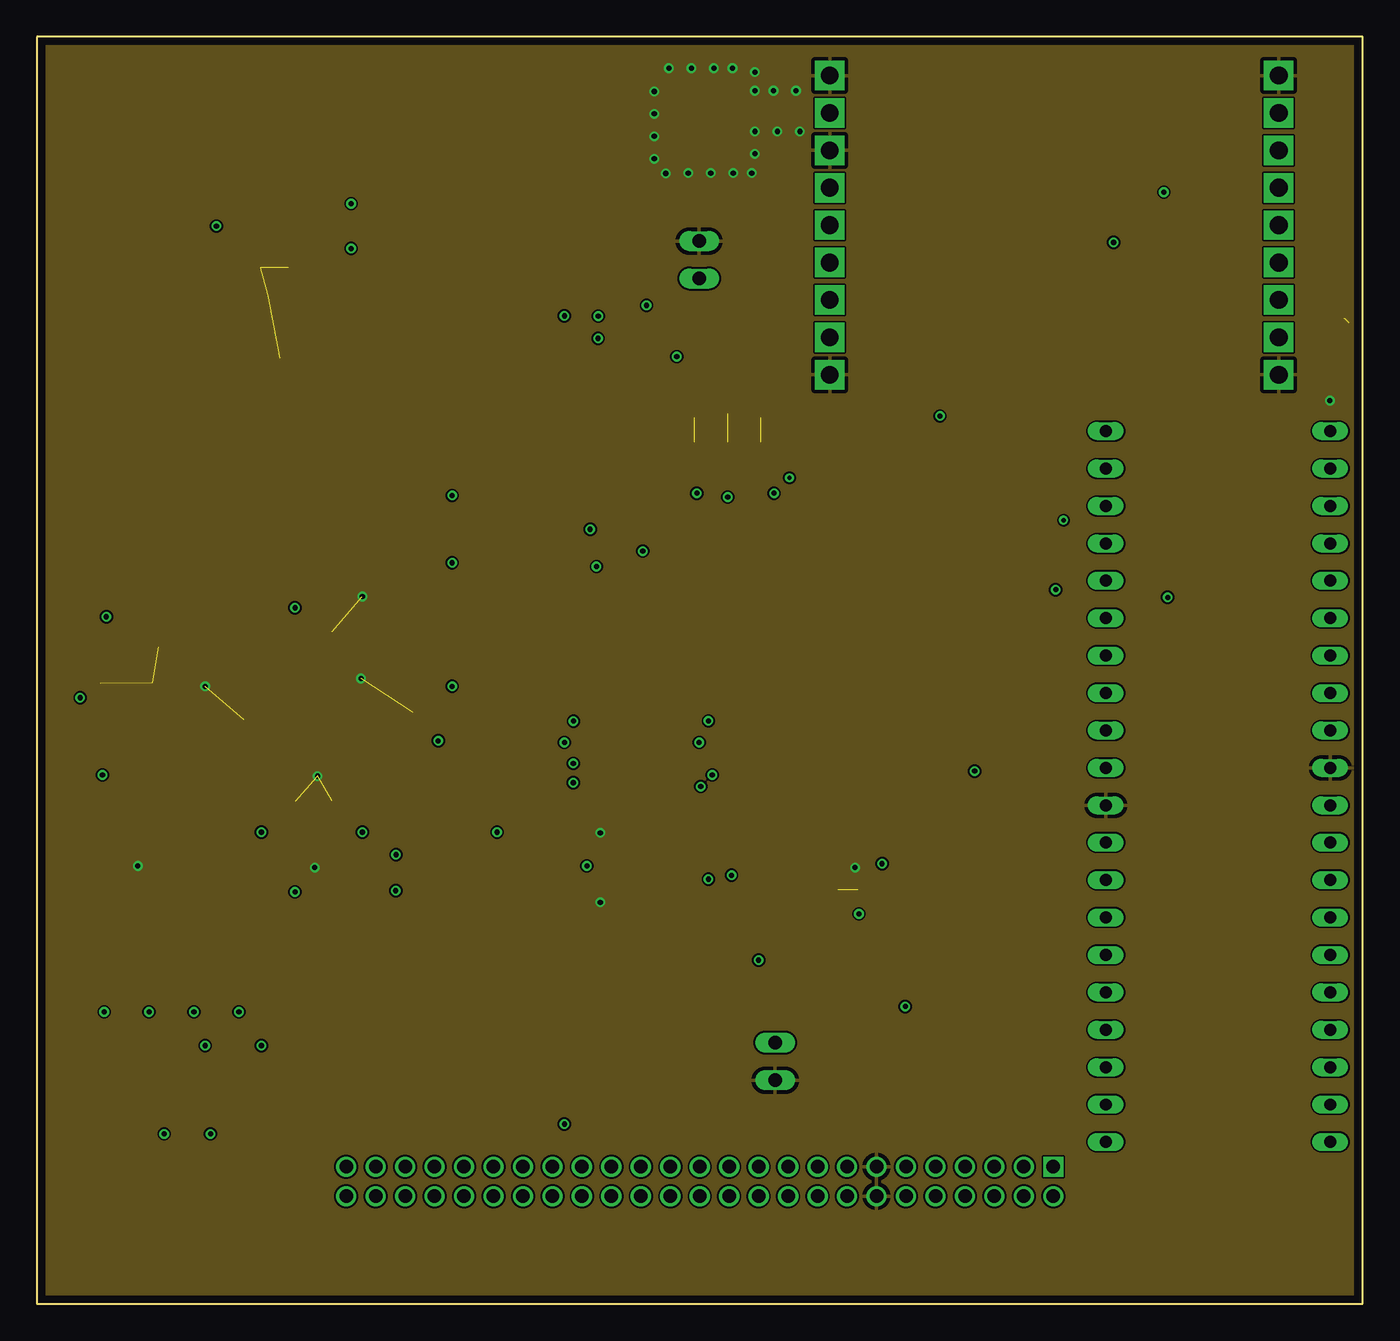
[diagram p7: board, inner layer Route15]
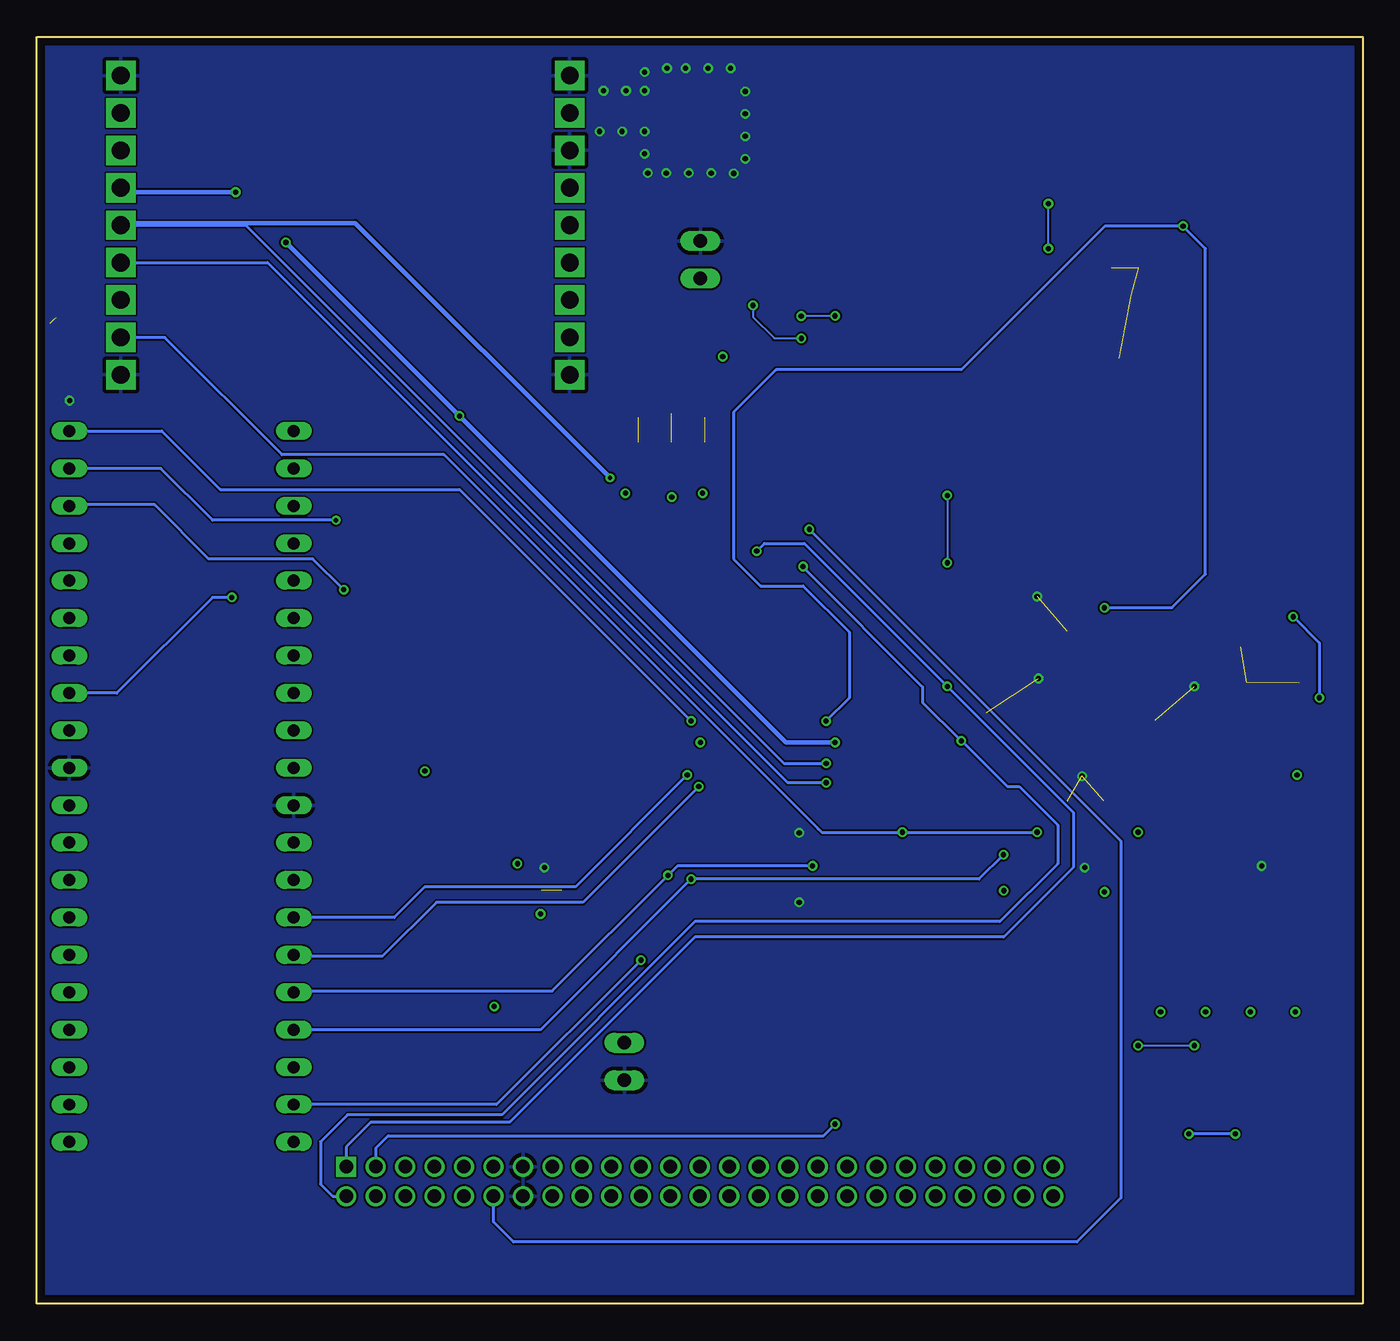
[diagram p8: board, bottom side, seen from below]

Size 90 x 86 mm. Coordinates in mm from the lower left corner, seen from the top.
Outline: 90,0 90,86 0,86 0,0 90,0
Copper layers (1+2*15+16): Top 0.018mm / dielectric 0.25mm / Route2 0.035mm / dielectric 1mm / Route15 0.035mm / dielectric 0.25mm / Bottom 0.018mm
Design rules "pban_5mil-l4": minimum track width 5mil, minimum drill 0.3mm, track to track 5mil, track to pad 0.229mm, pad to pad 5mil, via to via 5mil, smd to smd 5mil, copper to edge 0.5mm, drill to drill 0.5mm, minimum pad ring 0.15mm, minimum via ring 0.15mm, stop-mask expansion 4mil, vias tented up to drill 0.35mm, thermal gap 10mil

### Footprints (pad centres in the part's own frame; a part is rotated, then mirrored left to right if it is on the bottom)
SML0603 = smd 0.8 x 0.8: A 0.75,0; C -0.75,0
MABA-010245-BALUN = smd 0.762 x 1.397: P$1 0,3.43; P$2 1.27,3.43; P$3 2.54,3.43; P$4 2.54,0; P$5 0,0
C0603 = smd 1.1 x 1: 1 -0.85,0; 2 0.85,0
C0805 = smd 1.3 x 1.5: 1 -0.95,0; 2 0.95,0
SOIC127P1032X265-16N = smd 1.925 x 0.7: 1 -4.712,4.445; 2 -4.712,3.175; 3 -4.712,1.905; 4 -4.712,0.635; 5 -4.712,-0.635; 6 -4.712,-1.905; 7 -4.712,-3.175; 8 -4.712,-4.445; 9 4.712,-4.445; 10 4.712,-3.175; 11 4.712,-1.905; 12 4.712,-0.635; 13 4.712,0.635; 14 4.712,1.905; 15 4.712,3.175; 16 4.712,4.445
DIL40 = drill 0.813 long: 1 -24.13,-7.62; 2 -21.59,-7.62; 3 -19.05,-7.62; 4 -16.51,-7.62; 5 -13.97,-7.62; 6 -11.43,-7.62; 7 -8.89,-7.62; 8 -6.35,-7.62; 9 -3.81,-7.62; 10 -1.27,-7.62; 11 1.27,-7.62; 12 3.81,-7.62; 13 6.35,-7.62; 14 8.89,-7.62; 15 11.43,-7.62; 16 13.97,-7.62; 17 16.51,-7.62; 18 19.05,-7.62; 19 21.59,-7.62; 20 24.13,-7.62; 21 24.13,7.62; 22 21.59,7.62; 23 19.05,7.62; 24 16.51,7.62; 25 13.97,7.62; 26 11.43,7.62; 27 8.89,7.62; 28 6.35,7.62; 29 3.81,7.62; 30 1.27,7.62; 31 -1.27,7.62; 32 -3.81,7.62; 33 -6.35,7.62; 34 -8.89,7.62; 35 -11.43,7.62; 36 -13.97,7.62; 37 -16.51,7.62; 38 -19.05,7.62; 39 -21.59,7.62; 40 -24.13,7.62
RAB_ACCESS = smd 2.2 x 0.76: P$1 -0.15,-0.635; P$2 3.55,-0.635; P$3 -0.15,-1.905; P$4 3.55,-1.905; P$5 -0.15,-3.175; P$6 3.55,-3.175; P$7 -0.15,-4.445; P$8 3.55,-4.445; P$9 -0.15,-5.715; P$10 3.55,-5.715; P$11 -0.15,-6.985; P$12 3.55,-6.985; P$13 -0.15,-8.255; P$14 3.55,-8.255; P$15 -0.15,-9.525; P$16 3.55,-9.525; P$17 -0.15,-10.795; P$18 3.55,-10.795; P$19 -0.15,-12.065; P$20 3.55,-12.065; P$21 -0.15,-13.335; P$22 3.55,-13.335; P$23 -0.15,-14.605; P$24 3.55,-14.605
2X25M = drill 0.914 square: 1 -24,-1 | drill 0.914: 2 -24,1; 3 -22,-1; 4 -22,1; 5 -20,-1; 6 -20,1; 7 -18,-1; 8 -18,1; 9 -16,-1; 10 -16,1; 11 -14,-1; 12 -14,1; 13 -12,-1; 14 -12,1; 15 -10,-1; 16 -10,1; 17 -8,-1; 18 -8,1; 19 -6,-1; 20 -6,1; 21 -4,-1; 22 -4,1; 23 -2,-1; 24 -2,1; 25 0,-1; 26 0,1; 27 2,-1; 28 2,1; 29 4,-1; 30 4,1; 31 6,-1; 32 6,1; 33 8,-1; 34 8,1; 35 10,-1; 36 10,1; 37 12,-1; 38 12,1; 39 14,-1; 40 14,1; 41 16,-1; 42 16,1; 43 18,-1; 44 18,1; 45 20,-1; 46 20,1; 47 22,-1; 48 22,1; 49 24,-1; 50 24,1
JP1 = drill 0.914 long: 1 0,-1.27; 2 0,1.27
L2012C = smd 1 x 1: 1 -1,0; 2 1,0
QFP50P1200X1200X120-64N = smd 1.475 x 0.3: 1 -5.738,3.75; 2 -5.738,3.25; 3 -5.738,2.75; 4 -5.738,2.25; 5 -5.738,1.75; 6 -5.738,1.25; 7 -5.738,0.75; 8 -5.738,0.25; 9 -5.738,-0.25; 10 -5.738,-0.75; 11 -5.738,-1.25; 12 -5.738,-1.75; 13 -5.738,-2.25; 14 -5.738,-2.75; 15 -5.738,-3.25; 16 -5.738,-3.75; 33 5.738,-3.75; 34 5.738,-3.25; 35 5.738,-2.75; 36 5.738,-2.25; 37 5.738,-1.75; 38 5.738,-1.25; 39 5.738,-0.75; 40 5.738,-0.25; 41 5.738,0.25; 42 5.738,0.75; 43 5.738,1.25; 44 5.738,1.75; 45 5.738,2.25; 46 5.738,2.75; 47 5.738,3.25; 48 5.738,3.75 | smd 0.3 x 1.475: 17 -3.75,-5.738; 18 -3.25,-5.738; 19 -2.75,-5.738; 20 -2.25,-5.738; 21 -1.75,-5.738; 22 -1.25,-5.738; 23 -0.75,-5.738; 24 -0.25,-5.738; 25 0.25,-5.738; 26 0.75,-5.738; 27 1.25,-5.738; 28 1.75,-5.738; 29 2.25,-5.738; 30 2.75,-5.738; 31 3.25,-5.738; 32 3.75,-5.738; 49 3.75,5.738; 50 3.25,5.738; 51 2.75,5.738; 52 2.25,5.738; 53 1.75,5.738; 54 1.25,5.738; 55 0.75,5.738; 56 0.25,5.738; 57 -0.25,5.738; 58 -0.75,5.738; 59 -1.25,5.738; 60 -1.75,5.738; 61 -2.25,5.738; 62 -2.75,5.738; 63 -3.25,5.738; 64 -3.75,5.738
SOT65P210X110-6N = smd 1.05 x 0.4: 1 -1.05,0.65; 2 -1.05,0; 3 -1.05,-0.65; 4 1.05,-0.65; 5 1.05,0; 6 1.05,0.65
DFN = smd 0.25 x 0.7: 1 -0.675,-0.925; 2 -0.225,-0.925; 3 0.225,-0.925; 4 0.675,-0.925; 5 0.675,0.925; 6 0.225,0.925; 7 -0.225,0.925; 8 -0.675,0.925 | smd 1.37 x 0.64: 9 0,0
SO08 = smd 0.6 x 2.2: 1 -1.905,-2.6; 2 -0.635,-2.6; 3 0.635,-2.6; 4 1.905,-2.6; 5 1.905,2.6; 6 0.635,2.6; 7 -0.635,2.6; 8 -1.905,2.6
SOT346-R = smd 0.7 x 0.9: 1 0.95,-1.05; 2 -0.95,-1.05; 3 0,1.05
R0603 = smd 1 x 1.1: 1 -0.85,0; 2 0.85,0
R0805 = smd 1.3 x 1.5: 1 -0.95,0; 2 0.95,0
TRIM_PVG3A200C01R00 = smd 1.1 x 0.9: 1 1.15,-1.65; 3 -1.15,-1.65 | smd 1.4 x 0.9: 2 0,1.65
MMCX_908_222101T = smd 1.778 x 1.397: P$1 0,-1.841; P$3 0,1.841 | smd 1.27 x 1.778: P$2 1.905,0; P$4 -1.905,0
CHIPLED_0603 = smd 0.8 x 0.8: A 0,-0.75; C 0,0.75
FOX924B = smd 1.6 x 1.3: P$1 -2.1,-1.2; P$2 2.1,-1.2; P$3 2.1,1.2; P$4 -2.1,1.2
BIM1H = drill 1.2 pad 2 square: P$1 1.27,21.59; P$2 1.27,19.05; P$3 1.27,16.51; P$4 1.27,13.97; P$5 1.27,11.43; P$6 1.27,8.89; P$7 1.27,6.35; P$8 1.27,3.81; P$9 1.27,1.27; P$10 31.75,1.27; P$11 31.75,3.81; P$12 31.75,6.35; P$13 31.75,8.89; P$14 31.75,11.43; P$15 31.75,13.97; P$16 31.75,16.51; P$17 31.75,19.05; P$18 31.75,21.59
AX5243 = smd 0.3 x 0.3: ANTN 1.5,0.15; ANTP 2,0.15; CLK 1,3.85; CLK16N 3.85,1.5; CLK16P 3.85,1; FILT 0.15,1; GND2 2.5,0.15; GPADC1 3.85,2.5; GPADC2 3.85,2; IRQ 2.5,3.85; L1 0.15,2; L2 0.15,1.5; MISO 1.5,3.85; MOSI 2,3.85; SEL 0.15,3; SYSCLK 0.15,2.5; TCXO_EN 3,3.85; VDD_ANA 3,0.15; VDD_ANA2 1,0.15; VDD_IO 3.85,3 | smd 2.8 x 2.8: GND 2,2
SOT353-1 = smd 0.6 x 0.6: 1 -0.75,-0.9; 3 0.75,-0.9; 4 0.75,0.9; 5 -0.75,0.9 | smd 0.4 x 0.6: 2 0,-0.9
XTAL_ECS-200-18-30BQ-DS = smd 1.6 x 1.25: 1 -1.85,-1.1; 2 1.85,-1.1; 3 1.85,1.1; 4 -1.85,1.1
XTAL_ECS-80-18-20BQ-DS = smd 2 x 1.4: 1 -3,-1.27; 2 3,-1.27; 3 3,1.27; 4 -3,1.27

### Placement (x,y rotation side)
APD1  68.99,58.3 180 top
APD2  49.16,60.92 270 top
APD3  46.93,61.18 270 top
APD4  44.65,60.92 270 top
BAL  11.43,60.2 0 top
C1  9.17,47.95 0 top
C2  27.51,28.82 270 top
C3  69.43,42.18 90 top
C4  67.07,42.18 90 top
C5  69.43,35.37 90 top
C13  24.89,73.66 270 top
C14  31,51.18 90 top
C15  36.2,42.78 90 top
C16  25.4,59.69 90 top
C17  16.51,65.02 270 top
C18  5.08,31.23 270 top
C19  18.29,59.94 270 top
C20  8.64,62.74 270 top
C21  25.91,50.29 90 top
C22  23.37,50.29 90 top
C23  20.83,50.29 90 top
C24  18.29,50.29 90 top
C25  15.75,50.29 90 top
C26  13.21,50.29 90 top
C27  33.53,59.69 270 top
C28  21.34,78.74 270 top
C29  20.32,68.07 270 top
C30  68.23,25.7 270 top
C31  63.04,32.68 180 top
C35  53.45,28.08 180 top
C36  87.69,78.39 0 top
C37  87.69,80.91 0 top
C38  87.99,72.73 180 top
C39  61.82,50.97 270 top
C40  87.53,63.94 270 top
C41  54.02,43.34 270 top
C42  49.3,48.82 0 top
C43  51.78,35.69 270 top
C44  52.84,39.4 180 top
C45  47.86,45.63 270 top
FM_SF  30.48,21.08 0 top
IC2  80.17,35.11 270 top
JP1  42.42,32.51 180 top
JP2  45,8.3 180 top
JP3  50.12,16.45 180 top
JP4  44.96,70.87 0 top
L1  28.45,59.94 270 top
L2  21.59,59.69 270 top
L3  7.87,71.88 270 top
L5  68.12,38.78 180 top
MCU_SF  19.81,39.88 0 top
MOS1  34.54,70.36 90 top
MOS2  59.13,26.39 0 top
OCP1  35.56,65.02 270 top
OCP2  58.77,22.34 90 top
OPAMP  55.84,58.34 270 top
OPAMP1  56.11,50.27 270 top
Q1  38.89,60.83 0 top
Q2  55.22,18.81 90 top
Q3  55.2,15.02 90 top
R1  7.62,32 90 top
R2  10.16,32 90 top
R3  30.99,14.48 0 top
R4  18.29,22.35 0 top
R5  10.67,22.1 90 top
R6  4.32,38.35 270 top
R7  7.37,40.13 0 top
R8  14.48,22.1 90 top
R9  7.37,22.1 90 top
R10  39.62,70.36 90 top
R11  4.06,22.1 90 top
R12  19.05,25.4 0 top
R13  7.1,37.85 0 top
R14  44.19,66.6 180 top
R17  68.25,50.65 90 top
R18  53.33,24.86 0 top
R19  67.31,54.32 90 top
R20  53.56,22.36 0 top
R21  66.37,59.2 270 top
R22  49.16,57.63 90 top
R23  46.93,57.63 90 top
R24  44.65,57.63 90 top
R25  65.71,50.71 90 top
R26  87.96,66.82 0 top
R27  48.9,36.04 90 top
R28  55.19,36.38 0 top
R29  56.77,39.28 0 top
R30  63.86,54.19 0 top
R31  87.87,69.85 180 top
R32  58.75,43.64 0 top
R33  50.36,42.15 180 top
R34  51.22,45.77 270 top
R35  49.6,51.52 270 top
R36  63.44,59.14 270 top
R37  47.38,51.53 90 top
R38  66.29,46.11 270 top
R39  68.91,46.11 270 top
RFCON  45.2,80.57 90 top
SFD1  4.32,41.4 0 top
SFD2  7.11,42.16 270 top
TCXO  16.26,79.76 90 top
TRX1  52.55,61.79 0 top
TRX2  13.21,68.33 0 top
U1  9.17,45.33 270 top
U2  31.18,29.61 90 top
XTAL_AP  64.73,28.54 90 top
XTAL_SF  31.97,43.04 270 top

### Tracks (layer width: path | path; a pad name or v marks a point on that pad's centre or on a via)
APRS_AFIN  (via drill 0.35)  (2 unrouted)
  Top 0.2: v45.59,39.56 42.63,39.56 JP1.P$11
  Top 0.305: 88.72,66.92 R31.1 88.84,69.97 C38.1 | IC2.40 89.08,60.53 89.08,66.55
  Bottom 0.2: IC2.40 81.51,59.24 77.55,55.28 61.31,55.28 v45.59,39.56
APRS_AFOUT  (via drill 0.35)
  Top 0.2: JP1.P$13 45.69,40.77 47.16,39.3 47.16,36.42 48.48,35.1 48.99,35.1 R27.1 48.73,35.19 48.99,34.93 v48.99,23.32
  Bottom 0.2: v48.99,23.32 58.79,13.52 IC2.19
APRS_XTAL1
  Top 0.2: IC2.13 69.37,28.76 68.23,27.62 C30.1 65.98,26.55 XTAL_AP.1
APRS_XTAL2
  Top 0.2: XTAL_AP.3 63.67,30.39 63.67,32.46 C31.1 70.02,32.68 71.41,31.3 IC2.12
APRSDP_5V0  (via drill 0.35)  (1 unrouted)
  Top 0.15: v58.95,20.17 60.52,20.17 61.05,20.7 61.05,22.01 60.49,22.56 OCP2.3 | L5.1 69.46,38.44 69.46,36.38 | v63.67,36.16 63.73,36.22
  Top 0.2: TRX1.P$17 84.38,80.91 C37.1 C36.1 | IC2.10 69.46,36.38 C5.2 63.73,36.22 | 55.72,28.09 56.77,27.04 MOS2.1 56.39,27.04 v55.81,26.46 | OPAMP1.8 61.48,52.17 C39.1 62.17,51.82 64.14,49.86 R25.1 68.2,49.86 R17.1 | C35.1 55.59,28.08 v57.38,29.87 | 65.24,45.26 63.67,43.69 v63.67,36.16 | R38.2 R39.2
  Top 0.305: R38.2 65.24,45.26 65.04,45.26 64.71,45.59 64.71,48.86 R25.1
  Route2 0.2: v63.67,36.16 v57.38,29.87 | v55.81,26.46 55.81,22.01 57.64,20.17 v58.95,20.17
  Route2 0.305: TRX1.P$17 82.41,80.84 79.65,78.08 79.65,75.98 79.65,75.72 79.65,42.44 74.93,37.73 65.24,37.73 v63.67,36.16
APSF_MCU_RXB  (via drill 0.35)
  Top 0.2: v37.34,29.72 37.32,29.72 37.2,29.61 U2.2 | JP1.P$3 45.76,34.42 47.95,32.23 47.95,29.87 v47.16,29.08
  Bottom 0.2: v37.34,29.72 46.52,29.72 v47.16,29.08 55.02,21.22 72.47,21.22 IC2.16
APSF_MCU_RXB-2
  Top 0.2: MCU_SF.32 23.56,32.51 25.45,30.62 30.02,30.62 U2.4
APSF_MCU_TXB  (via drill 0.35)
  Top 0.2: MCU_SF.31 23.06,31.8 v24.38,30.48 | v45.59,28.82 46.37,29.61 46.37,31.96 45.19,33.15 JP1.P$1
  Bottom 0.2: v24.38,30.48 26.04,28.82 v45.59,28.82 55.81,18.6 IC2.17
AREF
  Top 0.2: IC2.32 85.53,38.92 83.05,41.4 83.05,57.9 86.2,61.05 86.2,63.93 87.06,64.79 C40.1 87.53,66.4 R26.1
AVCC
  Top 0.2: L5.2 67.07,38.82 C4.1 C3.1 70.41,40.35 75.72,40.35 82.23,33.84 IC2.30
CLK16P2  (via drill 0.35)
  Top 0.152: v21.34,74.68 C28.2 | TRX2.CLK16P 19.92,69.33 20.24,69 | 20.24,69 C29.1 | 20.24,69 20.24,70.53 v21.34,71.63
  Bottom 0.152: v21.34,71.63 v21.34,74.68
FM_RESET
  Top 0.152: FM_SF.3 22.72,22.99 22.09,22.35 R4.2
FM_W#
  Top 0.2: FM_SF.9 33.03,14.48 R3.2
GATE3  (via drill 0.35)
  Top 0.152: v38.12,67.04 38.86,66.29 38.86,65.4 38.26,64.8 OCP1.6 | v35.81,67.06 35.8,67.07 35.11,67.07 34.54,67.64 MOS1.2
  Bottom 0.152: v38.12,67.04 35.83,67.04 v35.81,67.06
GATE4
  Top 0.152: OCP2.6 57.83,22.58 57.37,22.58 56.41,23.55 56.41,25.75 57.05,26.39 MOS2.2
GND  (via drill 0.35)  (10 unrouted)
  other vias: 51.53,82.34 50.01,82.34 48.74,82.34 48.74,83.61 47.22,83.87 45.96,83.87 44.43,83.87 42.91,83.87 41.91,82.3 41.91,80.77 42.7,76.72 44.22,76.75 45.74,76.75 47.27,76.75 48.53,76.75 48.74,78.06 48.74,79.58 51.79,79.58 50.27,79.58 41.91,79.25 41.91,77.72 11.43,41.91 6.86,29.72 22.1,48.01 19.05,35.81 22.01,42.44 18.86,29.61 87.77,61.31 38.25,31.96 38.25,27.25 55.54,29.61
  pour Bottom: -5.08,90.17 93.98,90.17 93.98,-5.08 -5.08,-5.08
  pour Top: -1.31,88.56 91.44,88.56 91.44,-1.57 -1.57,-1.57 -1.57,88.29
  pour Route15: -2.88,89.34 92.75,89.34 93.01,89.08 93.01,-3.14 -3.67,-3.14 -3.67,88.56
HOLD
  Top 0.152: R12.2 25.64,25.4 FM_SF.1
LED
  Top 0.152: R7.2 10.76,42.67 14.03,42.67 MCU_SF.3
LED2_GRN  (via drill 0.35)
  Top 0.2: v50.04,55.02 49.16,55.9 R22.1
  Route2 0.2: IC2.2 70.85,56.7 69.17,55.02 v50.04,55.02
LED3_YLW  (via drill 0.35)
  Top 0.2: v46.9,54.76 46.9,56.75 R23.1
  Route2 0.2: IC2.3 47.5,54.16 v46.9,54.76
LED4_BLU  (via drill 0.35)
  Top 0.2: v44.8,55.02 44.8,56.63 R24.1
  Route2 0.2: IC2.4 68.64,51.62 66.81,53.45 46.37,53.45 v44.8,55.02
MB_DIO_APRSDP_5V0
  Top 0.2: Q3.2 56.33,14.15 57.12,14.15 59,12.26 JP2.11
MB_DIO_SFWARD_3V3  (via drill 0.35)
  Top 0.2: Q2.2 64.14,17.86 70.74,11.27 70.74,5.5 68.91,3.67 61.05,3.67 58.95,5.76 58.95,7.25 JP2.12 | v37.56,52.56 37.94,52.94 Q1.2
  Bottom 0.2: v37.56,52.56 16.41,31.41 16.41,7.17 19.39,4.19 57.64,4.19 59,5.55 JP2.12
MB_SF_RX  (via drill 0.35)
  Top 0.2: U1.2 5.2,45.33 1.93,42.06 1.93,18.14 8.55,11.53 v8.65,11.53 | v11.79,11.53 25.68,11.53 27,10.2 JP2.43
  Bottom 0.2: v8.65,11.53 v11.79,11.53
MB_SF_RX-2
  Top 0.2: U1.4 11.23,44.58 12.18,43.63 MCU_SF.1 16.57,43.63 26.19,34 29.96,34 36.72,40.77 JP1.P$14
MB_SF_TX
  Top 0.2: JP1.P$16 39.97,42.04 40.39,41.62 40.39,32.5 39.12,31.24 27.97,31.24 16.08,43.13 MCU_SF.2 3.5,43.13 2.29,41.91 2.29,19.31 10.01,11.59 10.07,11.53 16.88,4.72 25.94,4.72 27,5.78 JP2.44
MCLR  (via drill 0.35)
  Top 0.2: MCU_SF.7 10.73,40.63 R13.2 2.64,32.54 2.64,20.22 10.67,12.19 v35.81,12.19 40.89,17.26 40.89,44.08 41.39,44.58 JP1.P$19
  Bottom 0.2: v35.81,12.19 36.6,11.41 66.15,11.41 67,10.55 JP2.3
N$2
  Top 0.2: C18.1 5.08,32.6 11.61,39.13 MCU_SF.10
N$7
  Top 0.2: MCU_SF.14 11.89,37.13 R1.2
N$8
  Top 0.2: R2.2 10.16,33.78 13.01,36.63 MCU_SF.15
N$9
  Top 0.152: R6.1 SFD1.A
N$10
  Top 0.2: R29.2 57.62,41.96 R32.3
N$11
  Top 0.152: SFD2.A 6.52,42.01 R7.1
N$12
  Top 0.2: APD1.A 68.19,58.35 R21.2
N$13  (1 unrouted)
N$14  (1 unrouted)
N$15  (1 unrouted)
N$16
  Top 0.2: R27.2 49.16,36.63 51.52,36.63 51.87,36.54 C43.1 54.18,36.54 R28.1
N$17
  Top 0.152: 53.75,39.34 C44.1
  Top 0.2: R28.2 56.04,39.16 R29.1 53.81,39.28 53.75,39.34
N$18
  Top 0.2: C42.1 48.45,47.08 C45.1 49.51,44.83 R33.2
N$19
  Top 0.2: C41.2 51.55,42.49 R33.1
N$20
  Top 0.2: R35.2 49.84,50.9 OPAMP1.2
  Top 0.305: R37.1 49.59,50.68 R35.2
N$21
  Top 0.2: R25.2 65.76,51.61 65.76,53.14 R30.2 64.71,55.28 63.56,56.44 OPAMP.5
N$22
  Top 0.2: R32.2 55.12,45.29 C41.1
N$34  (via drill 0.35)
  Top 0.2: R38.1 66.29,47.68 67.07,48.47 v69.17,48.47
  Bottom 0.2: v69.17,48.47 71.26,50.57 78.34,50.57 82.01,54.23 87.72,54.23 IC2.38
N$35
  Top 0.152: TRX2.VDD_ANA2 14.21,68.31 9.49,63.59 C20.1
N$36
  Top 0.152: TRX2.VDD_ANA 16.21,66.18 C17.1
N$37
  Top 0.152: L3.2 9.89,70.88 10.95,69.83 TRX2.L2
N$38  (via drill 0.35)
  Top 0.2: R39.1 69.89,47.95 v76.77,47.95
  Bottom 0.2: v76.77,47.95 78.08,47.95 84.56,41.46 IC2.33
N$41
  Top 0.152: L3.1 9.41,72.88 11.97,70.33 TRX2.L1
N$42
  Top 0.152: L1.2 28.24,58.74 C16.1
N$43
  Top 0.152: C16.2 25.39,60.69 22.1,60.69 | L2.1 22.1,60.69 | BAL.P$4 14.67,60.89 C19.1 21.89,60.89 22.1,60.69
N$44
  Top 0.152: TRX2.ANTN 14.71,68.05 11.43,64.77 BAL.P$1
N$45
  Top 0.152: BAL.P$3 13.72,63.88 13.72,66.29 15.24,67.82 15.24,68.44 TRX2.ANTP
N$46
  Top 0.152: TCXO.P$3 17.66,79.25 20.99,79.25 C28.1
ON3
  Top 0.152: OCP1.4 34.22,64.35 33.8,63.93 33.8,63.4 35.33,61.88 Q1.3
  Top 0.2: Q1.3 42.23,61.88 45.04,64.69 R14.1
  Top 0.406: JP4.1 45.04,69.52 R14.1
ON4
  Top 0.152: Q2.3 60.21,18.81 61.57,20.17 61.57,22.01 60.56,23.01 OCP2.4
  Top 0.2: Q3.3 54.17,15.04 Q2.3 54.1,18.74 | 54.1,18.74 53.08,17.72 JP3.1 | R20.1 54.1,20.96 54.1,18.74
OPAMP_A+
  Top 0.2: OPAMP1.3 52.14,49.63 | 52.14,49.63 51.99,49.63 51.35,48.99 51.22,48.86 R34.1 | 52.14,49.63 51.33,48.82 C42.2
OSC1
  Top 0.152: C14.1 31,46.34 XTAL_SF.1
  Top 0.2: MCU_SF.40 25.57,39.65 26.86,39.65 30.7,43.49 XTAL_SF.1
OSC2
  Top 0.2: MCU_SF.39 28.47,39.13 29.34,38.25 31.45,38.25 XTAL_SF.3 35.13,41.93 C15.1
PA1  (via drill 0.3)
  Top 0.2: R17.2 67.31,52.45 R19.1 67.59,53.19 v69.69,53.19
  Bottom 0.2: v69.69,53.19 78.08,53.19 81.59,56.7 IC2.39
PD0_RXA  (via drill 0.35)
  Top 0.2: JP1.P$7 44.79,36.96 v45.85,35.89
  Bottom 0.2: v45.85,35.89 53.45,28.3 63.67,28.3 65.74,26.22 IC2.14
PD1_TXA  (via drill 0.35)
  Top 0.2: JP1.P$5 42.62,35.63 44.54,35.63 v45.06,35.11
  Bottom 0.2: v45.06,35.11 52.92,27.25 62.88,27.25 66.55,23.58 72.45,23.58 IC2.15
PGC  (via drill 0.35)
  Top 0.152: v28.19,41.91 26.91,40.63
  Top 0.2: 26.91,40.63 MCU_SF.42 | v41.13,51.09 44.8,47.42 44.8,44.54 43.57,43.31 JP1.P$17
  Bottom 0.2: v41.13,51.09 40.61,51.61 37.9,51.61 v28.19,41.91 19.65,33.37 19.65,29.61 24.37,24.89 45.33,24.89 57.9,12.31 67.33,12.31 69,10.65 JP2.1
PGD  (via drill 0.35)
  Top 0.2: MCU_SF.37 27.17,38.13 v27.25,38.21 | v37.99,50.04 40.35,52.4 42.18,52.4 45.59,48.99 45.59,43.75 43.75,41.92 42.69,41.92 JP1.P$15
  Bottom 0.2: v37.99,50.04 37.99,50 29.87,41.88 29.87,40.83 v27.25,38.21 27.2,38.21 24.1,35.11 23.32,35.11 20.7,32.49 20.7,29.87 24.63,25.94 45.33,25.94 58.43,12.84 68.91,12.84 70.74,11 70.74,8.12 69.92,7.3 JP2.2
RSSI  (via drill 0.35)
  Top 0.2: v22.1,32 21.06,33.04 MCU_SF.27 | JP1.P$4 38.74,34.29 37.84,34.29 35.55,32 v31.24,32
  Bottom 0.2: v22.1,32 v31.24,32 31.26,31.98 36.7,31.98 36.94,32.23 62.36,57.64 73.36,57.64 81.32,65.6 TRX1.P$11
SENSE3  (via drill 0.35)
  Top 0.152: MOS1.6 33.89,72.76 34.29,73.15 38.86,73.15 39.62,72.39 R10.2 40.71,71.31 41.39,70.63 v41.39,67.77 | v38.1,65.53 37.82,65.25 OCP1.7
  Bottom 0.152: v41.39,67.77 41.39,66.98 39.93,65.53 v38.1,65.53
SENSE4
  Top 0.152: OCP2.7 57.83,22.13 56.06,22.13 55.54,22.65 55.54,23.59 R18.2 54.28,25.63 53.45,26.46 51.09,26.46 50.04,27.51 50.04,29.34 51.35,30.65 60,30.65 61.31,29.34 61.31,27.51 60.84,27.04 MOS2.6
SFWARD_3V3_2  (via drill 0.35)
  Top 0.152: 16,49.44 C22.1 C21.1 27.34,49.44 v28.19,50.29 | C23.1 19.56,48.18 MCU_SF.57 | TRX2.VDD_IO 18.54,72.81 C13.2 28.39,69.31 MOS1.1 32.77,68.18 32.77,66.21 34.18,64.8 | v28.19,54.86 28.19,56.39 32.45,60.64 C27.1 32.77,61.4 32.77,63.39 34.18,64.8 | 34.18,64.8 OCP1.3
  Top 0.2: R13.1 4.67,37.85 R6.2 | 18.12,25.32 R12.1 17.53,26.07 v17.53,27.96 | 18.12,25.32 17.44,24.64 R4.1 16.33,21.25 R8.1 14.48,20.57 v13.72,19.81 | R3.1 12.95,14.48 v7.62,19.81 7.37,20.07 R9.1 | FM_SF.2 19.18,24.26 18.12,25.32 | v15.24,32 16.06,32.83 MCU_SF.17 16.06,35.11 17.53,36.58 18.29,36.58 | 18.29,36.58 19.81,36.58 20.56,35.83 MCU_SF.26 | MCU_SF.19 17.06,35.35 18.29,36.58 | v4.57,19.81 4.06,20.32 R11.1 | v10.67,19.81 R5.1 | C23.1 C24.1 | C26.1 16,49.44 C24.1 | C24.1 C25.1 | v4.72,46.64 7.52,49.44 C26.1 | v2.94,41.13 2.94,38.88 R6.2 | MCU_SF.38 22.68,38.63 17.03,44.28 14.93,44.28 13.1,46.11 10.07,46.11 | U1.5 10.07,46.11 | 10.07,46.11 10.07,47.68 | 10.07,47.68 10.07,47.9 C1.2 | C26.1 11.45,47.68 10.07,47.68 | U2.5 29.39,27.97 C2.2 27.45,28.03 v24.37,28.03 | R6.2 4.32,36.03 v4.45,35.89 | v44.96,38.1 42.7,38.1 JP1.P$9
  Route2 0.152: v24.37,28.03 24.29,27.96
  Route2 0.2: v13.72,19.81 v10.67,19.81 v7.62,19.81 v4.57,19.81 | v44.96,38.1 43.8,36.94 40.61,36.94 31.7,28.03 v24.37,28.03 | 24.29,27.96 v17.53,27.96 15.24,30.24 v15.24,32 13.71,33.54 6.81,33.54 v4.45,35.89
  Bottom 0.152: v28.19,54.86 v28.19,50.29
  Bottom 0.2: v4.72,46.64 2.94,44.86 v2.94,41.13
SPI_FM_CS  (via drill 0.35)
  Top 0.152: v11.43,17.53 9.14,19.81 9.14,21.17 R9.2 7.37,25.65 11.12,29.41 14.65,29.41 18.56,33.32 MCU_SF.22 | v15.24,17.53 25.39,17.53 FM_SF.7
  Bottom 0.152: v15.24,17.53 v11.43,17.53
SPI_MISO
  Top 0.152: FM_SF.8 13.84,16.64 12.19,18.29 12.19,21.42 R5.2 10.67,28.19 11.43,28.96 14.7,28.96 19.06,33.32 MCU_SF.23
SPI_MOSI
  Top 0.152: R8.2 14.48,28.19 19.56,33.28
  Top 0.2: 19.56,33.28 MCU_SF.24 19.56,31.71 24.36,26.91 30.22,26.91 32.87,24.26 FM_SF.15
SPI_SCK
  Top 0.152: R11.2 10.83,29.72 14.48,29.72 18.06,33.3 MCU_SF.21
  Top 0.2: FM_SF.16 36.96,25.53 38.86,23.62 38.86,16.76 35.05,12.95 12.19,12.95 5.33,19.81 5.33,21.68 R11.2
SUP_3V3_1
  Top 0.2: JP2.50 JP2.49
SUP_3V3_2  (via drill 0.35)
  Top 0.152: R10.1 38.23,69.41 37.47,68.64 37.47,66.02 37.14,65.7 OCP1.8
  Top 0.2: v43.43,64.29 43.43,66.69 R14.2 40.56,66.6 39.62,67.53 R10.1
  Route2 0.2: v43.43,64.29 43.43,53.34 49.03,47.74 49.03,26.17 45.03,22.17 45.03,9.31 JP2.26 JP2.25
SUP_5V0
  Top 0.152: OCP2.8 55.1,21.66 R20.2 54.41,22.88 53.71,23.58 52.92,23.58 52.66,23.84 52.66,24.57 R18.1
  Top 0.305: R18.1 52.38,24.34 47.95,19.91 47.95,14.15 49.52,12.58 53.19,12.58 55,10.76 JP2.15 JP2.16
TCXO_EN2
  Top 0.152: TCXO.P$4 15.06,73.71 16.21,72.56 TRX2.TCXO_EN
TRX1
  Top 0.61: RFCON.P$1 47.31,80.84 TRX1.P$2
TRX1_AFOUT  (via drill 0.35)
  Top 0.2: JP1.P$6 36.73,35.69 v36.42,35.37
  Top 0.305: TRX1.P$13 85.08,70.68 C38.2
  Bottom 0.2: TRX1.P$13 74.34,70.68 39.04,35.37 v36.42,35.37
TRX1_RXSELECT
  Top 0.2: OPAMP.6 60.37,57.7 62.66,59.99 R36.1 63.5,60.05 R21.1 67.19,59.24 IC2.1
  Top 0.305: TRX1.P$16 81.96,78.3 72.57,68.91 72.57,59.26 IC2.1
TRX1_TXD  (via drill 0.3, 0.35)
  Top 0.2: JP1.P$8 38.85,36.94 36.68,36.94 v36.42,36.68
  Top 0.305: v51.09,56.07 51.09,53.19 52.1,52.17 OPAMP1.1 49.8,52.17 R35.1
  Bottom 0.2: TRX1.P$14 75.84,73.22 39.3,36.68 v36.42,36.68
  Bottom 0.305: TRX1.P$14 83.72,73.22 83.58,73.36 68.38,73.36 v51.09,56.07
TRX1_TXSELECT  (via drill 0.35)
  Top 0.2: v35.81,38.1 35.94,38.23 JP1.P$10
  Top 0.305: OPAMP.7 60.02,58.98 v61.31,60.26 | v73.1,72.05 v76.5,75.46
  Bottom 0.305: v35.81,38.1 39.15,38.1 v61.31,60.26 v73.1,72.05 | v76.5,75.46 84,75.46 TRX1.P$15
TRX2_MOSI  (via drill 0.35)
  Top 0.2: MCU_SF.60 18.06,46.71 v17.53,47.24 | v12.19,73.15 14.71,73.15 15.21,72.65 TRX2.MOSI | JP1.P$12 38.81,39.55 v36.43,39.55
  Bottom 0.2: v17.53,47.24 12.95,47.24 10.67,49.53 10.67,71.63 v12.19,73.15 17.5,73.15 27.25,63.4 39.82,63.4 42.71,60.52 42.71,50.57 40.87,48.73 37.99,48.73 34.85,45.59 34.85,41.13 v36.43,39.55